# EAGLE design PX4FLOW1.3.1 (EAGLE 6.5.0)

## Sheet 1 of 3
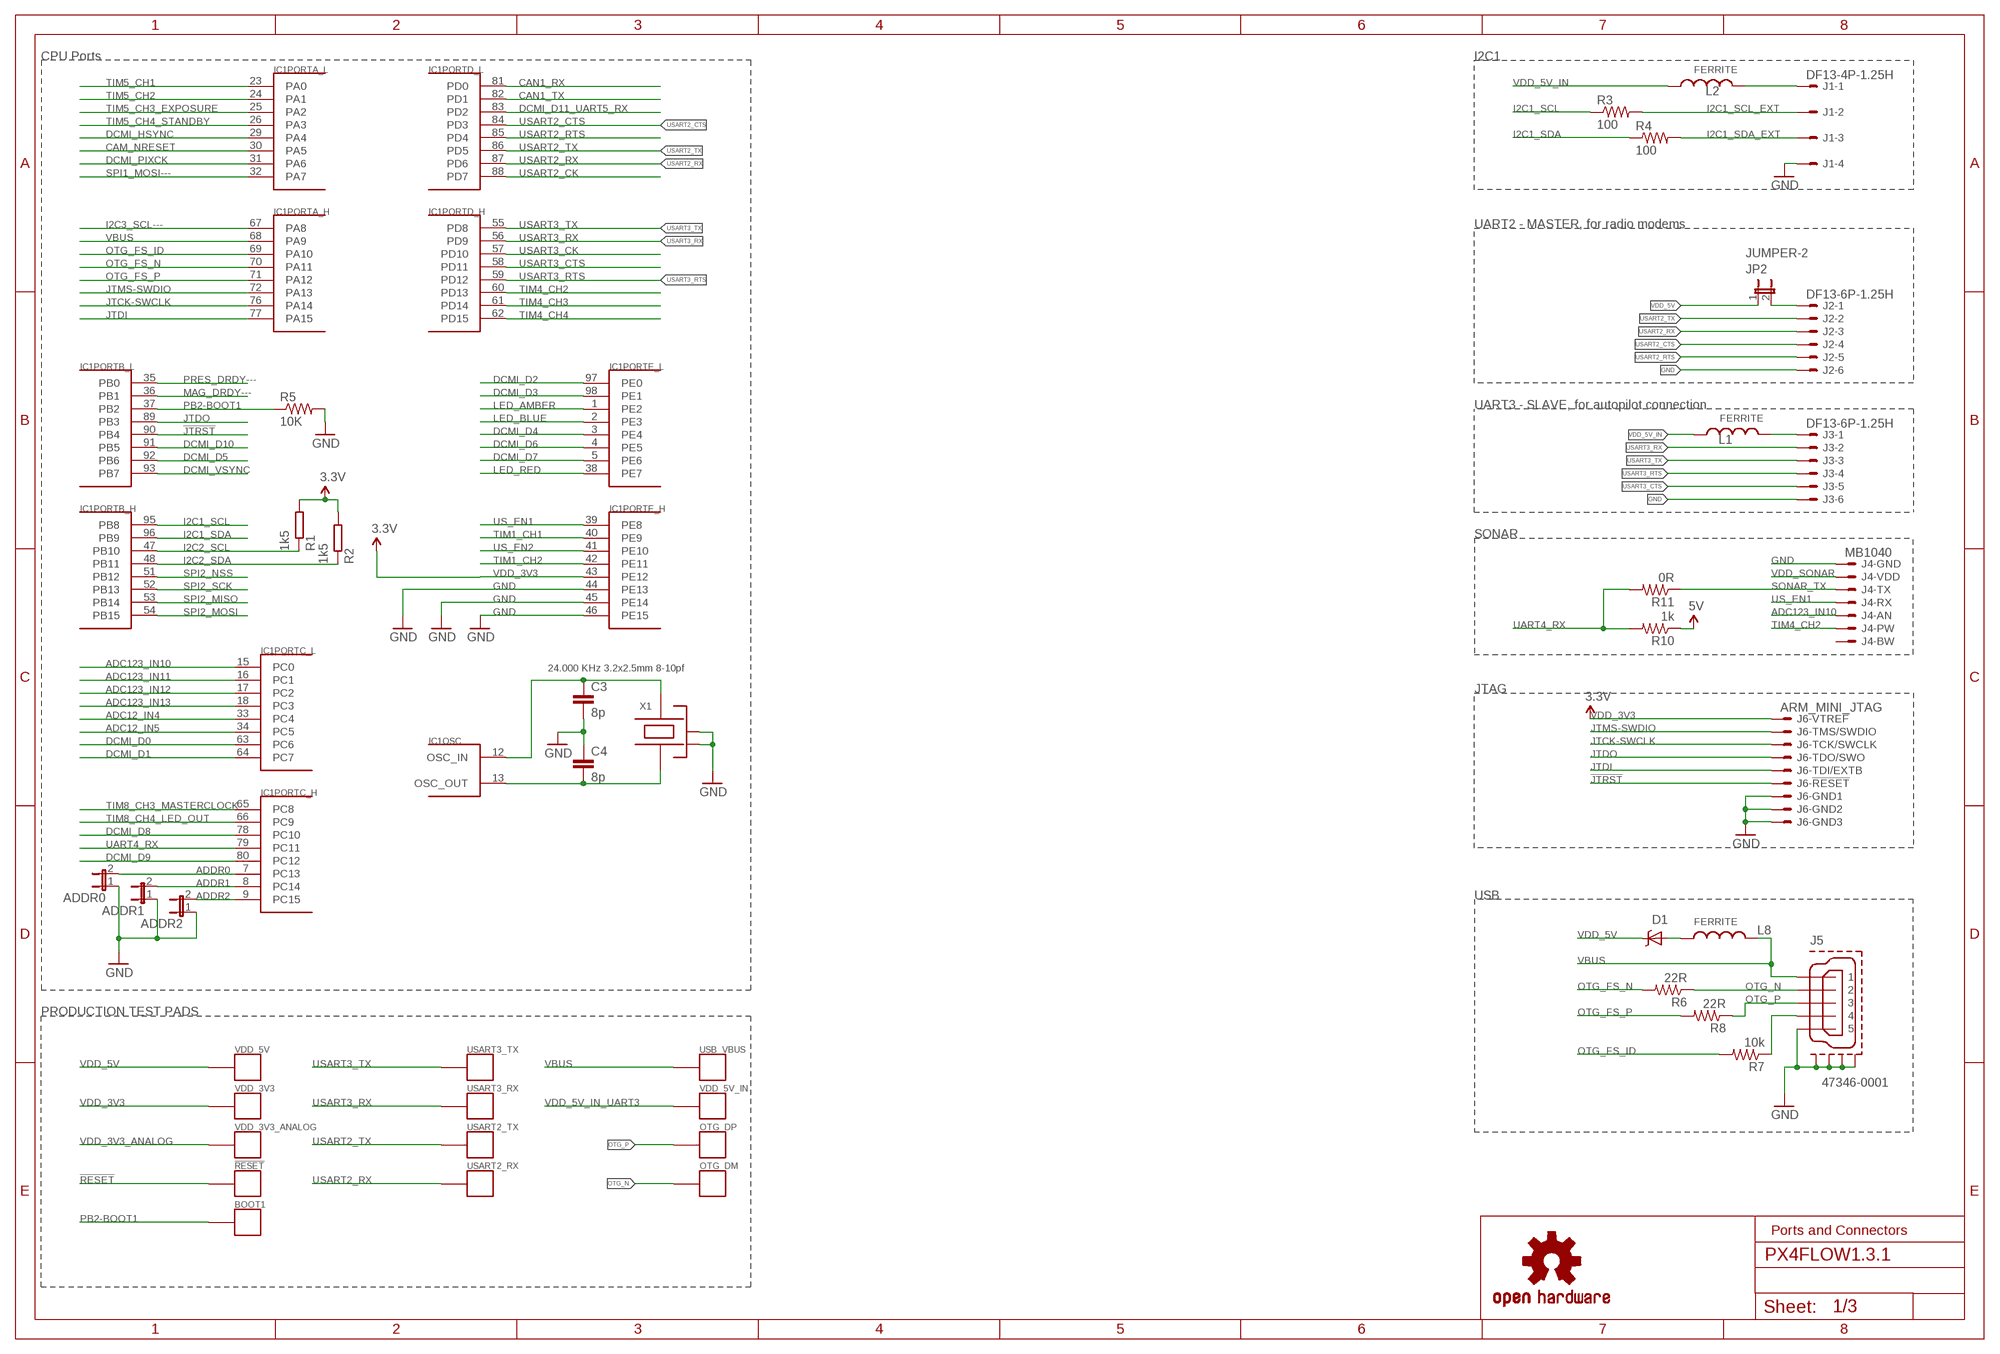
[diagram p0: schematic, sheet 1]

### Parts
!RESET  PAD.04  [PAD.04X.04]
ADDR0  JUMPER-2  [SJ_2]
ADDR1  JUMPER-2  [SJ_2]
ADDR2  JUMPER-2  [SJ_2]
BOOT1  PAD.04  [PAD.04X.04]
C3  8p  CAPACITOR-0402  [0402-CAP]
C4  8p  CAPACITOR-0402  [0402-CAP]
D1  MSS1P4-M3  DIODE-SCHOTTKY_MSMP  [MICROSMP]
IC1  STM32F4X7VX  [TQFP100]
J1  DF13-4P-1.25H  [DF13A-4P-1.25H]
J2  DF13-6P-1.25H  [DF13A-6P-1.25H]
J3  DF13-6P-1.25H  [DF13A-6P-1.25H]
J4  MB1040  MAXSONAR  [MAXSONAR]
J5  47346-0001  MOLEX-47346-0001  [MOLEX-47346-0001]
J6  ARM_MINI_JTAG  ARM_MINI_JTAG-SMT  [FTSH-105-01-XXX-DV-K]
JP2  JUMPER-2  [SJ_2]
L1  FERRITE  INDUCTOR0402  [0402-IND]
L2  FERRITE  INDUCTOR0402  [0402-IND]
L8  FERRITE  INDUCTOR0402  [0402-IND]
OTG_DM  PAD.04  [PAD.04X.04]
OTG_DP  PAD.04  [PAD.04X.04]
R1  1k5  RESISTOR-0402  [0402-RES]
R2  1k5  RESISTOR-0402  [0402-RES]
R3  100  RESISTOR0402-RES  [0402-RES]
R4  100  RESISTOR0402-RES  [0402-RES]
R5  10K  RESISTOR0402-RES  [0402-RES]
R6  22R  RESISTOR0402-RES  [0402-RES]
R7  10k  RESISTOR0402-RES  [0402-RES]
R8  22R  RESISTOR0402-RES  [0402-RES]
R10  1k  RESISTOR0402-RES  [0402-RES]
R11  0R  RESISTOR0402-RES  [0402-RES]
U$10  OSHW-LOGOS  [OSHW-LOGO-S]
USART2_RX  PAD.04  [PAD.04X.04]
USART2_TX  PAD.04  [PAD.04X.04]
USART3_RX  PAD.04  [PAD.04X.04]
USART3_TX  PAD.04  [PAD.04X.04]
USB_VBUS  PAD.04  [PAD.04X.04]
VDD_3V3  PAD.04  [PAD.04X.04]
VDD_3V3_ANALOG  PAD.04  [PAD.04X.04]
VDD_5V  PAD.04  [PAD.04X.04]
VDD_5V_IN  PAD.04  [PAD.04X.04]
X1  24.000 KHz 3.2x2.5mm 8-10pf  OSCILLATOR-3.2X2.5  [OSCILLATOR-3.2X2.5]

### Nets
!JTRST: IC1.90(PORTB_L:PB4) J6.10
!RESET [power]: !RESET.P$1 ; also sheet 2
ADC12_IN4: IC1.33(PORTC_L:PC4)
ADC12_IN5: IC1.34(PORTC_L:PC5)
ADC123_IN10: IC1.15(PORTC_L:PC0) J4.AN
ADC123_IN11: IC1.16(PORTC_L:PC1)
ADC123_IN12: IC1.17(PORTC_L:PC2)
ADC123_IN13: IC1.18(PORTC_L:PC3)
ADDR0: ADDR0.2 IC1.7(PORTC_H:PC13)
ADDR1: ADDR1.2 IC1.8(PORTC_H:PC14)
ADDR2: ADDR2.2 IC1.9(PORTC_H:PC15)
CAM_NRESET: IC1.30(PORTA_L:PA5) ; also sheet 3
CAN1_RX: IC1.81(PORTD_L:PD0)
CAN1_TX: IC1.82(PORTD_L:PD1)
DCMI_D0: IC1.63(PORTC_L:PC6) ; also sheet 3
DCMI_D1: IC1.64(PORTC_L:PC7) ; also sheet 3
DCMI_D2: IC1.97(PORTE_L:PE0) ; also sheet 3
DCMI_D3: IC1.98(PORTE_L:PE1) ; also sheet 3
DCMI_D4: IC1.3(PORTE_L:PE4) ; also sheet 3
DCMI_D5: IC1.92(PORTB_L:PB6) ; also sheet 3
DCMI_D6: IC1.4(PORTE_L:PE5) ; also sheet 3
DCMI_D7: IC1.5(PORTE_L:PE6) ; also sheet 3
DCMI_D8: IC1.78(PORTC_H:PC10) ; also sheet 3
DCMI_D9: IC1.80(PORTC_H:PC12) ; also sheet 3
DCMI_D10: IC1.91(PORTB_L:PB5)
DCMI_D11_UART5_RX: IC1.83(PORTD_L:PD2)
DCMI_HSYNC: IC1.29(PORTA_L:PA4) ; also sheet 3
DCMI_PIXCK: IC1.31(PORTA_L:PA6) ; also sheet 3
DCMI_VSYNC: IC1.93(PORTB_L:PB7) ; also sheet 3
GND [power]: ADDR0.1 ADDR1.1 ADDR2.1 C3.P$2 C4.P$1 IC1.44(PORTE_H:PE13) IC1.45(PORTE_H:PE14) IC1.46(PORTE_H:PE15) J1.4 J2.6 J3.6 J4.GND J5.GND J5.GND1 J5.GND2 J5.GND3 J5.GND4 J6.3 J6.5 J6.9 R5.2 X1.2(NC_2) X1.4(NC_4) ; also sheet 2,3
I2C1_SCL: IC1.95(PORTB_H:PB8) R3.1
I2C1_SCL_EXT: J1.2 R3.2
I2C1_SDA: IC1.96(PORTB_H:PB9) R4.1
I2C1_SDA_EXT: J1.3 R4.2
I2C2_SCL: IC1.47(PORTB_H:PB10) R1.P$1 ; also sheet 2,3
I2C2_SDA: IC1.48(PORTB_H:PB11) R2.P$1 ; also sheet 2,3
I2C3_SCL---: IC1.67(PORTA_H:PA8)
JTCK-SWCLK: IC1.76(PORTA_H:PA14) J6.4
JTDI: IC1.77(PORTA_H:PA15) J6.8
JTDO: IC1.89(PORTB_L:PB3) J6.6
JTMS-SWDIO: IC1.72(PORTA_H:PA13) J6.2
LED_AMBER: IC1.1(PORTE_L:PE2) ; also sheet 2
LED_BLUE: IC1.2(PORTE_L:PE3) ; also sheet 2
LED_RED: IC1.38(PORTE_L:PE7) ; also sheet 2
MAG_DRDY---: IC1.36(PORTB_L:PB1)
N$1: C4.P$2 IC1.13(OSC:OSC_OUT) X1.1
N$2: C3.P$1 IC1.12(OSC:OSC_IN) X1.3
N$3: J1.1 L2.P$2
N$13: J2.1 JP2.2
N$23 [power]: D1.ANODE(A) L8.P$1
OTG_FS_ID: IC1.69(PORTA_H:PA10) R7.2
OTG_FS_N: IC1.70(PORTA_H:PA11) R6.2
OTG_FS_P: IC1.71(PORTA_H:PA12) R8.2
OTG_ID: J5.ID R7.1
OTG_N: J5.D- OTG_DM.P$1 R6.1
OTG_P: J5.D+ OTG_DP.P$1 R8.1
PB2-BOOT1: BOOT1.P$1 IC1.37(PORTB_L:PB2) R5.1
PRES_DRDY---: IC1.35(PORTB_L:PB0)
SONAR_TX: J4.TX R11.1
SPI1_MOSI---: IC1.32(PORTA_L:PA7)
SPI2_MISO: IC1.53(PORTB_H:PB14) ; also sheet 3
SPI2_MOSI: IC1.54(PORTB_H:PB15) ; also sheet 3
SPI2_NSS: IC1.51(PORTB_H:PB12) ; also sheet 3
SPI2_SCK: IC1.52(PORTB_H:PB13) ; also sheet 3
TIM1_CH1: IC1.40(PORTE_H:PE9)
TIM1_CH2: IC1.42(PORTE_H:PE11)
TIM4_CH2: IC1.60(PORTD_H:PD13) J4.PW
TIM4_CH3: IC1.61(PORTD_H:PD14)
TIM4_CH4: IC1.62(PORTD_H:PD15)
TIM5_CH1: IC1.23(PORTA_L:PA0)
TIM5_CH2: IC1.24(PORTA_L:PA1)
TIM5_CH3_EXPOSURE: IC1.25(PORTA_L:PA2) ; also sheet 3
TIM5_CH4_STANDBY: IC1.26(PORTA_L:PA3) ; also sheet 3
TIM8_CH3_MASTERCLOCK: IC1.65(PORTC_H:PC8) ; also sheet 3
TIM8_CH4_LED_OUT: IC1.66(PORTC_H:PC9) ; also sheet 3
UART4_RX: IC1.79(PORTC_H:PC11) R10.2 R11.2
US_EN1: IC1.39(PORTE_H:PE8) J4.RX
US_EN2: IC1.41(PORTE_H:PE10)
USART2_CK: IC1.88(PORTD_L:PD7)
USART2_CTS: IC1.84(PORTD_L:PD3) J2.4
USART2_RTS: IC1.85(PORTD_L:PD4) J2.5
USART2_RX: IC1.87(PORTD_L:PD6) J2.3 USART2_RX.P$1
USART2_TX: IC1.86(PORTD_L:PD5) J2.2 USART2_TX.P$1
USART3_CK: IC1.57(PORTD_H:PD10)
USART3_CTS: IC1.58(PORTD_H:PD11) J3.5
USART3_RTS: IC1.59(PORTD_H:PD12) J3.4
USART3_RX: IC1.56(PORTD_H:PD9) J3.2 USART3_RX.P$1
USART3_TX: IC1.55(PORTD_H:PD8) J3.3 USART3_TX.P$1
VBUS [power]: IC1.68(PORTA_H:PA9) J5.VBUS L8.P$2 USB_VBUS.P$1
VDD_3V3 [power]: IC1.43(PORTE_H:PE12) J6.1 R1.P$2 R2.P$2 VDD_3V3.P$1 ; supply symbol labelled 3.3V ; also sheet 2,3
VDD_3V3_ANALOG [power]: VDD_3V3_ANALOG.P$1 ; also sheet 2,3
VDD_5V [power]: D1.CATHODE(C) JP2.1 R10.1 VDD_5V.P$1 ; supply symbol labelled 5V ; also sheet 2
VDD_5V_IN [power]: L1.P$1 L2.P$1 ; also sheet 2
VDD_5V_IN_UART3: J3.1 L1.P$2 VDD_5V_IN.P$1
VDD_SONAR: J4.VDD ; also sheet 2
Unconnected: J4.BW

### Notes on the sheet
- CPU Ports | I2C1
- UART2 - MASTER, for radio modems
- UART3 - SLAVE, for autopilot connection
- SONAR
- JTAG
- USB
- PRODUCTION TEST PADS
- Ports and Connectors

## Sheet 2 of 3
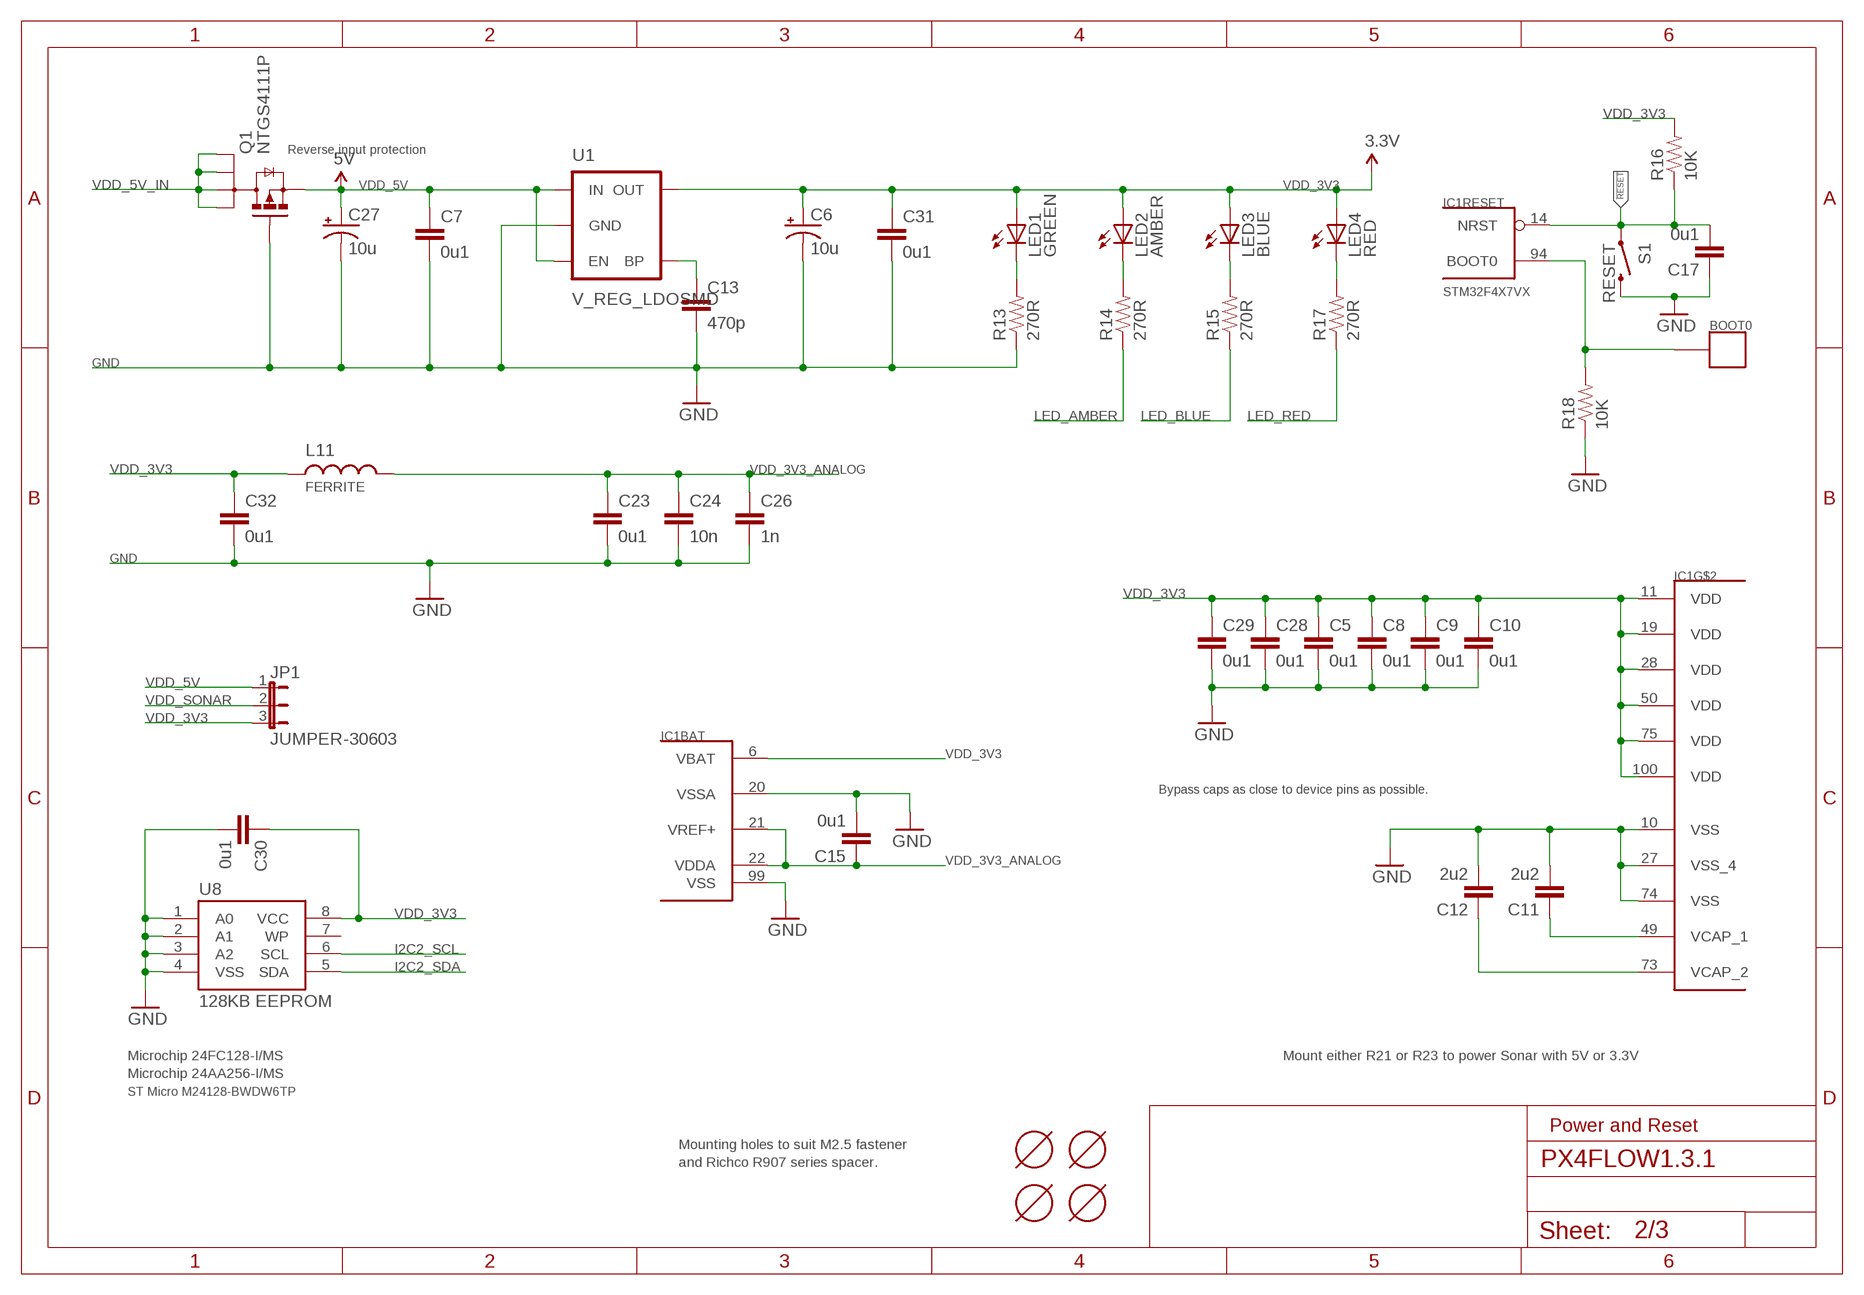
[diagram p1: schematic, sheet 2]

### Parts
BOOT0  PAD.05  [PAD.05X.05]
C5  0u1  CAP0402-CAP  [0402-CAP]
C6  10u  CAP_POL1206  [EIA3216]
C7  0u1  CAP0402-CAP  [0402-CAP]
C8  0u1  CAP0402-CAP  [0402-CAP]
C9  0u1  CAP0402-CAP  [0402-CAP]
C10  0u1  CAP0402-CAP  [0402-CAP]
C11  2u2  CAP0402-CAP  [0402-CAP]
C12  2u2  CAP0402-CAP  [0402-CAP]
C13  470p  CAP0402-CAP  [0402-CAP]
C15  0u1  CAP0402-CAP  [0402-CAP]
C17  0u1  CAP0402-CAP  [0402-CAP]
C23  0u1  CAP0402-CAP  [0402-CAP]
C24  10n  CAP0402-CAP  [0402-CAP]
C26  1n  CAP0402-CAP  [0402-CAP]
C27  10u  CAP_POL1206  [EIA3216]
C28  0u1  CAP0402-CAP  [0402-CAP]
C29  0u1  CAP0402-CAP  [0402-CAP]
C30  0u1  CAP0402-CAP  [0402-CAP]
C31  0u1  CAP0402-CAP  [0402-CAP]
C32  0u1  CAP0402-CAP  [0402-CAP]
JP1  JUMPER-30603  [SJ_3_0603_PASTE1&2]
L11  FERRITE  INDUCTOR0402  [0402-IND]
LED1  GREEN  LED0603  [LED-0603]
LED2  AMBER  LED0603  [LED-0603]
LED3  BLUE  LED0603  [LED-0603]
LED4  RED  LED0603  [LED-0603]
Q1  NTGS4111P  [TSOP-6]
R13  270R  RESISTOR0402-RES  [0402-RES]
R14  270R  RESISTOR0402-RES  [0402-RES]
R15  270R  RESISTOR0402-RES  [0402-RES]
R16  10K  RESISTOR0402-RES  [0402-RES]
R17  270R  RESISTOR0402-RES  [0402-RES]
R18  10K  RESISTOR0402-RES  [0402-RES]
S1  RESET  SWITCH-MOMENTARY-2  [EVQP7J01K]
U1  V_REG_LDOSMD  [SOT23-5]
U8  128KB EEPROM  EEPROM-I2CMSOP  [MSOP-8]
U$1  MOUNT-HOLE3.1MM  [MOUNT-HOLE3.1]
U$2  MOUNT-HOLE3.1MM  [MOUNT-HOLE3.1]
U$3  MOUNT-HOLE3.1MM  [MOUNT-HOLE3.1]
U$4  MOUNT-HOLE3.1MM  [MOUNT-HOLE3.1]

### Nets
!RESET [power]: C17.2 IC1.14(RESET:NRST) R16.1 S1.A1 ; also sheet 1
BOOT0: BOOT0.P$1 IC1.94(RESET:BOOT0) R18.2
GND [power]: C5.2 C6.C(-) C7.2 C8.2 C9.2 C10.2 C11.2 C12.2 C13.2 C15.2 C17.1 C23.2 C24.2 C26.2 C27.C(-) C28.2 C29.2 C30.2 C31.2 C32.2 IC1.10(VSS) IC1.20(BAT:VSSA) IC1.27(VSS_4) IC1.74(VSS) IC1.99(BAT:VSS) Q1.3(G) R13.1 R18.1 S1.B3 U1.2(GND) U8.1(A0) U8.2(A1) U8.3(A2) U8.4(VSS) ; also sheet 1,3
I2C2_SCL: U8.6(SCL) ; also sheet 1,3
I2C2_SDA: U8.5(SDA) ; also sheet 1,3
LED_AMBER: R14.1 ; also sheet 1
LED_BLUE: R15.1 ; also sheet 1
LED_RED: R17.1 ; also sheet 1
N$4: C13.1 U1.4(BP)
N$8: LED4.C R17.2
N$28: LED3.C R15.2
N$29: LED1.C R13.2
N$30: LED2.C R14.2
VCAP_1: C11.1 IC1.49(VCAP_1)
VCAP_2: C12.1 IC1.73(VCAP_2)
VDD_3V3 [power]: C5.1 C6.A(+) C8.1 C9.1 C10.1 C28.1 C29.1 C30.1 C31.1 C32.1 IC1.6(BAT:VBAT) IC1.11(VDD) IC1.19(VDD) IC1.28(VDD) IC1.50(VDD) IC1.75(VDD) IC1.100(VDD) JP1.3 L11.P$1 LED1.A LED2.A LED3.A LED4.A R16.2 U1.5(OUT) U8.8(VCC) ; supply symbol labelled 3.3V ; also sheet 1,3
VDD_3V3_ANALOG [power]: C15.1 C23.1 C24.1 C26.1 IC1.21(BAT:VREF+) IC1.22(BAT:VDDA) L11.P$2 ; also sheet 1,3
VDD_5V [power]: C7.1 C27.A(+) JP1.1 Q1.4(S) U1.1(IN) U1.3(EN) ; supply symbol labelled 5V ; also sheet 1
VDD_5V_IN [power]: Q1.1(D) Q1.2(D1) Q1.5(D2) Q1.6(D3) ; also sheet 1
VDD_SONAR: JP1.2 ; also sheet 1
Unconnected: U8.7(WP)

### Notes on the sheet
- Reverse input protection
- Bypass caps as close to device pins as possible.
- Microchip 24FC128-I/MS | Mount either R21 or R23 to power Sonar with 5V or 3.3V
- Microchip 24AA256-I/MS
- ST Micro M24128-BWDW6TP
- Power and Reset
- Mounting holes to suit M2.5 fastener
- and Richco R907 series spacer.

## Sheet 3 of 3
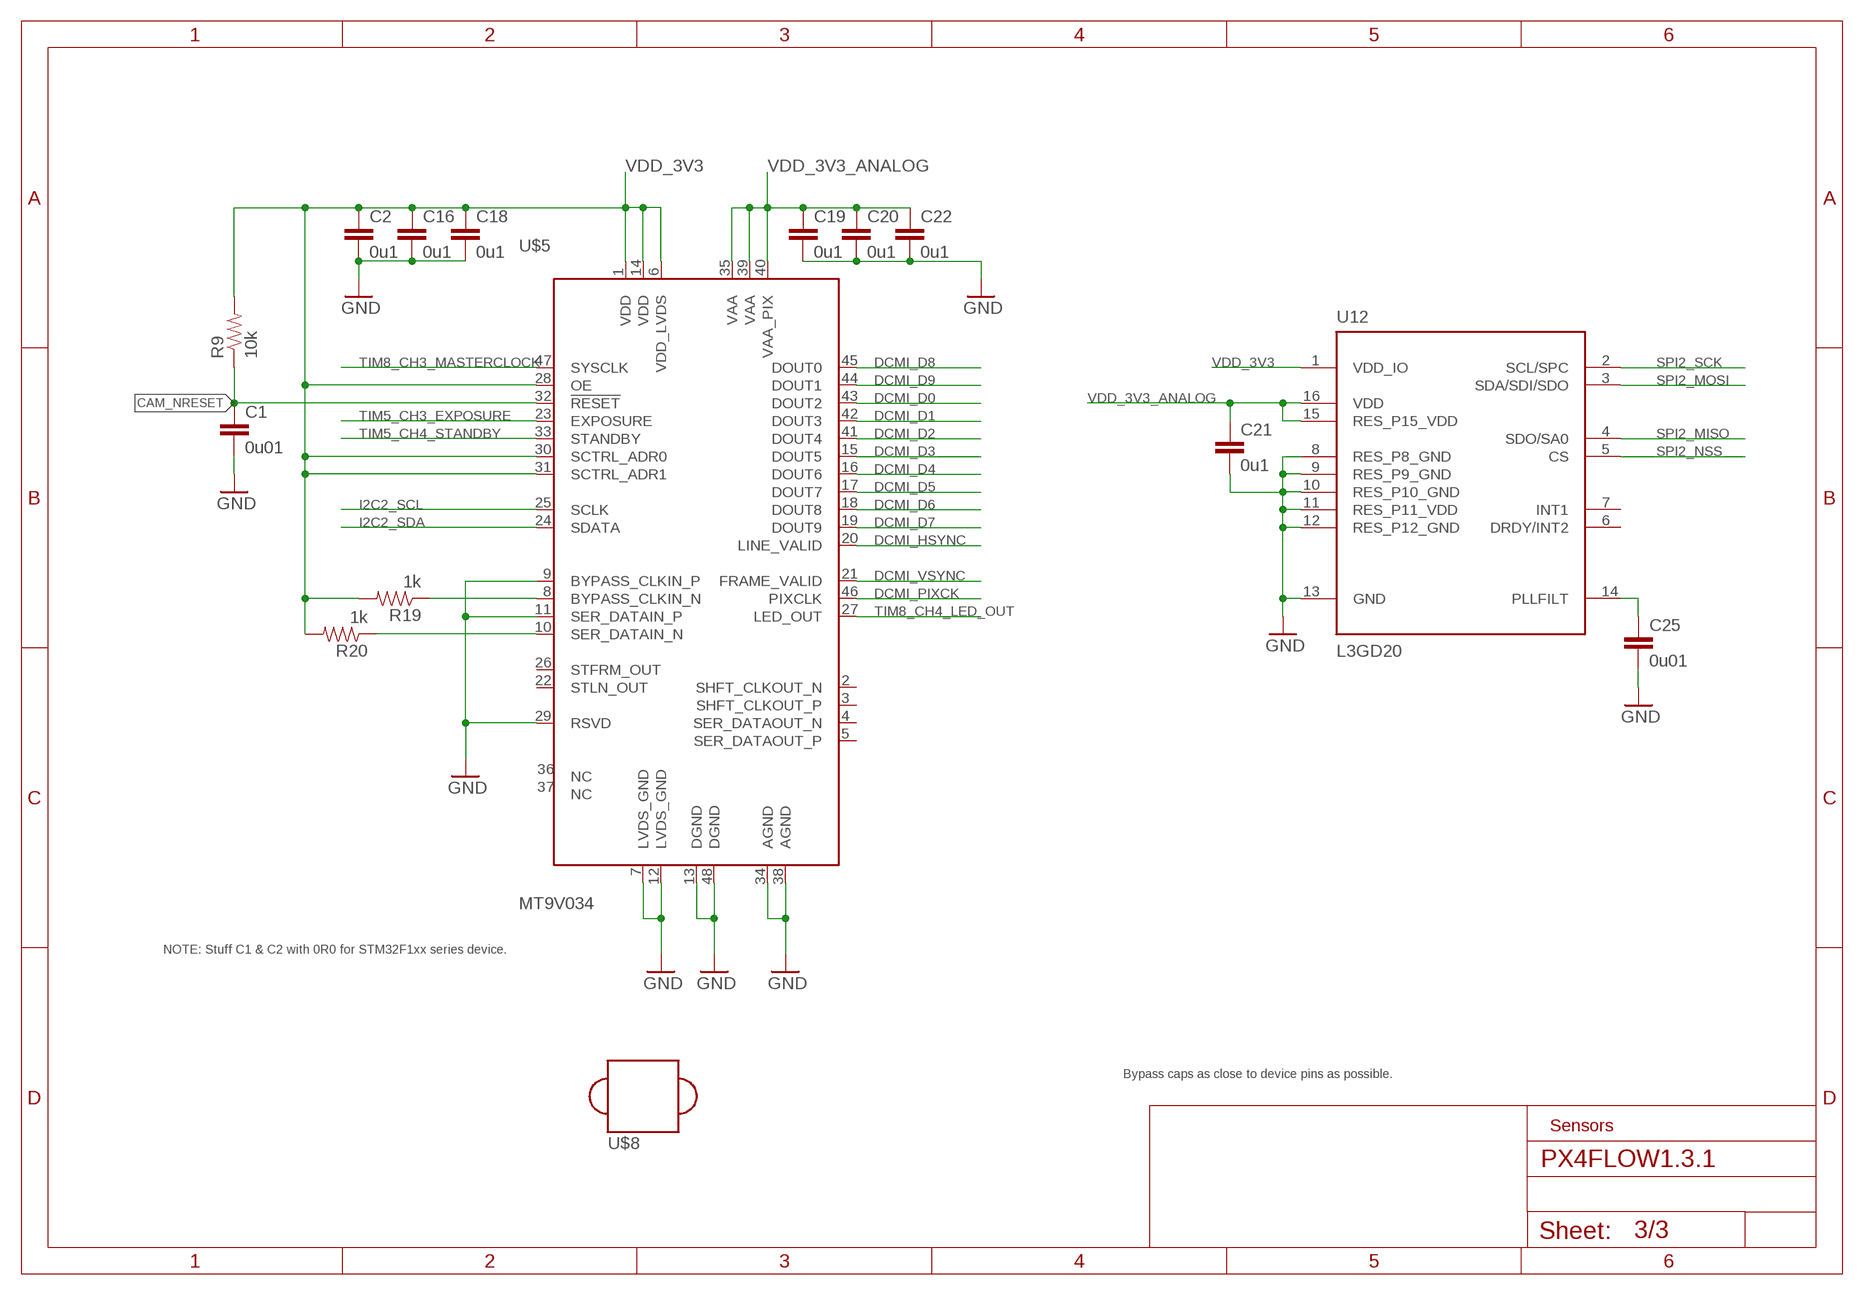
[diagram p2: schematic, sheet 3]

### Parts
C1  0u01  CAP0402-CAP  [0402-CAP]
C2  0u1  CAP0402-CAP  [0402-CAP]
C16  0u1  CAP0402-CAP  [0402-CAP]
C18  0u1  CAP0402-CAP  [0402-CAP]
C19  0u1  CAP0402-CAP  [0402-CAP]
C20  0u1  CAP0402-CAP  [0402-CAP]
C21  0u1  CAP0402-CAP  [0402-CAP]
C22  0u1  CAP0402-CAP  [0402-CAP]
C25  0u01  CAP0402-CAP  [0402-CAP]
R9  10k  RESISTOR0402-RES  [0402-RES]
R19  1k  RESISTOR0402-RES  [0402-RES]
R20  1k  RESISTOR0402-RES  [0402-RES]
U12  L3GD20  L3G4200DH-LL  [L3G4200DH-MAN]
U$5  MT9V034  [CLCC-48]
U$8  LENSMOUNT_M12  [LENSMOUNT_LARGE_M12]

### Nets
CAM_NRESET: C1.1 R9.1 U$5.32(!RESET) ; also sheet 1
DCMI_D0: U$5.43(DOUT2) ; also sheet 1
DCMI_D1: U$5.42(DOUT3) ; also sheet 1
DCMI_D2: U$5.41(DOUT4) ; also sheet 1
DCMI_D3: U$5.15(DOUT5) ; also sheet 1
DCMI_D4: U$5.16(DOUT6) ; also sheet 1
DCMI_D5: U$5.17(DOUT7) ; also sheet 1
DCMI_D6: U$5.18(DOUT8) ; also sheet 1
DCMI_D7: U$5.19(DOUT9) ; also sheet 1
DCMI_D8: U$5.45(DOUT0) ; also sheet 1
DCMI_D9: U$5.44(DOUT1) ; also sheet 1
DCMI_HSYNC: U$5.20(LINE_VALID) ; also sheet 1
DCMI_PIXCK: U$5.46(PIXCLK) ; also sheet 1
DCMI_VSYNC: U$5.21(FRAME_VALID) ; also sheet 1
GND [power]: C1.2 C2.2 C16.2 C18.2 C19.2 C20.2 C21.2 C22.2 C25.2 U12.8(RES_P8_GND) U12.9(RES_P9_GND) U12.10(RES_P10_GND) U12.11(RES_P11_VDD) U12.12(RES_P12_GND) U12.13(GND) U$5.7(LVDS_GND) U$5.9(BYPASS_CLKIN_P) U$5.11(SER_DATAIN_P) U$5.12(LVDS_GND) U$5.13(DGND) U$5.29(RSVD) U$5.34(AGND) U$5.38(AGND) U$5.48(DGND) ; also sheet 1,2
I2C2_SCL: U$5.25(SCLK) ; also sheet 1,2
I2C2_SDA: U$5.24(SDATA) ; also sheet 1,2
N$10: R19.1 U$5.8(BYPASS_CLKIN_N)
N$11: R20.1 U$5.10(SER_DATAIN_N)
N$34: C25.1 U12.14(PLLFILT)
SPI2_MISO: U12.4(SDO/SA0) ; also sheet 1
SPI2_MOSI: U12.3(SDA/SDI/SDO) ; also sheet 1
SPI2_NSS: U12.5(CS) ; also sheet 1
SPI2_SCK: U12.2(SCL/SPC) ; also sheet 1
TIM5_CH3_EXPOSURE: U$5.23(EXPOSURE) ; also sheet 1
TIM5_CH4_STANDBY: U$5.33(STANDBY) ; also sheet 1
TIM8_CH3_MASTERCLOCK: U$5.47(SYSCLK) ; also sheet 1
TIM8_CH4_LED_OUT: U$5.27(LED_OUT) ; also sheet 1
VDD_3V3 [power]: C2.1 C16.1 C18.1 R9.2 R19.2 R20.2 U12.1(VDD_IO) U$5.1(VDD) U$5.6(VDD_LVDS) U$5.14(VDD) U$5.28(OE) U$5.30(SCTRL_ADR0) U$5.31(SCTRL_ADR1) ; also sheet 1,2
VDD_3V3_ANALOG [power]: C19.1 C20.1 C21.1 C22.1 U12.15(RES_P15_VDD) U12.16(VDD) U$5.35(VAA) U$5.39(VAA) U$5.40(VAA_PIX) ; also sheet 1,2
Unconnected: U12.6(DRDY/INT2) U12.7(INT1) U$5.2(SHFT_CLKOUT_N) U$5.3(SHFT_CLKOUT_P) U$5.4(SER_DATAOUT_N) U$5.5(SER_DATAOUT_P) U$5.22(STLN_OUT) U$5.26(STFRM_OUT) U$5.36(NC) U$5.37(NC)

### Notes on the sheet
- NOTE: Stuff C1 & C2 with 0R0 for STM32F1xx series device.
- Bypass caps as close to device pins as possible.
- Sensors

## Library data of the parts
!RESET BOOT0 BOOT1 OTG_DM OTG_DP USART2_RX USART2_TX USART3_RX USART3_TX USB_VBUS VDD_3V3 VDD_3V3_ANALOG VDD_5V VDD_5V_IN = pixhawk2:PAD: Test pad This footprint includes three classes: The actual test pads, a pogo-pin footprint to mount the pogo-pin as through-hole part and a hole footprint which allows the head of the pogo-pin to pass through (do NOT use the hole to mount the pogo-pin). In a typical test setup, the stack would consist of three PCBs: The actual PCB under testing with a test pad on the bottom, then a second PCB with the hole for the pogo-pin head where the PCB under testing is pressed on and a third PCB at 30 mm / 1.2" distance with the pogo-pin footprints. The pogo-pins are soldered to the last PCB. To create the stack, copy the board under testing and exchange the footprints - this way the correct positioning is ensured.; BOM: EXCLUDE; PARTNO: *
ADDR0 ADDR1 ADDR2 JP2 = pixhawk2:JUMPER-2; BOM: EXCLUDE; PARTNO: *
C1 C25 = pixhawk2:CAP: Capacitor Standard 0603 ceramic capacitor, and 0.1" leaded capacitor.; PARTNO: CC0402KRX7R7BB103
C2 C5 C7-C10 C15-C24 C26 C28-C32 = pixhawk2:CAP: Capacitor Standard 0603 ceramic capacitor, and 0.1" leaded capacitor.; PARTNO: CC0402ZRY5V7BB104
C3 C4 = pel_dipol_comp:CAPACITOR
C6 C27 = pixhawk2:CAP_POL: Capacitor Polarized These are standard SMD and PTH capacitors. Normally 10uF, 47uF, and 100uF in electrolytic and tantalum varieties. Always verify the external diameter of the through hole cap, it varies with capacity, voltage, and manufacturer. The EIA devices should be standard.; PARTNO: F931A106MAA
C11 C12 = pixhawk2:CAP: Capacitor Standard 0603 ceramic capacitor, and 0.1" leaded capacitor.; PARTNO: C1608Y5V1C225Z
C13 = pixhawk2:CAP: Capacitor Standard 0603 ceramic capacitor, and 0.1" leaded capacitor.; PARTNO: CC0402KRX7R9BB471
D1 = pixhawk2:DIODE-SCHOTTKY: Schottky barrier diode in DO214AC, e.g. Fairchild SS14.; PARTNO: MSS1P4-M3/89A
IC1 = pixhawk2:STM32F4X7VX: STM32F4X7VX 100 pin LQFP STM32F407VE - 512 KB flash, no crypto STM32F407VG - 1 MB flash, no crypto STM32F417VE - 512 KB flash, with crypto STM32F417VG - 1 MB flash, with crypto; PARTNO: STM32F407VGT6
J1 = pixhawk2:DF13-4P-1.25?; PARTNO: DF13A-4P-1.25H(20)
J2 J3 = pixhawk2:DF13-6P-1.25?; PARTNO: DF13A-6P-1.25H(20)
J4 = pixhawk2:MAXSONAR; BOM: EXCLUDE; PARTNO: *
J5 = pixhawk2:MOLEX-47346-0001: MICRO USB B, BOTTOM MOUNT; PARTNO: 47346-0001
J6 = pixhawk2:ARM_MINI_JTAG: CONNECTOR wire to board 1.25 mm (.049 inch) pitch header; PARTNO: M50-3900542
JP1 = pixhawk2:JUMPER-3; PARTNO: RMCF0402ZT0R00
L1 L2 L8 L11 = pixhawk2:INDUCTOR: Inductors Basic Inductor/Choke - 0603 and 1210. Footprints are not proven and vary greatly between part numbers. SRR1210: Bourns SRR1210 parts, e.g. SRR1210-100M; PARTNO: BKP1005HS121-T
LED1 = pixhawk2:LED: LEDs Standard schematic elements and footprints for 5mm, 3mm, 1206, and 0603 sized LEDs. 5mm - Spark Fun Electronics SKU : COM-00529 (and others); PARTNO: LNJ337W83RA
LED2 = pixhawk2:LED: LEDs Standard schematic elements and footprints for 5mm, 3mm, 1206, and 0603 sized LEDs. 5mm - Spark Fun Electronics SKU : COM-00529 (and others); PARTNO: LNJ437W84RA
LED3 = pixhawk2:LED: LEDs Standard schematic elements and footprints for 5mm, 3mm, 1206, and 0603 sized LEDs. 5mm - Spark Fun Electronics SKU : COM-00529 (and others); PARTNO: LNJ937W8CRA
LED4 = pixhawk2:LED: LEDs Standard schematic elements and footprints for 5mm, 3mm, 1206, and 0603 sized LEDs. 5mm - Spark Fun Electronics SKU : COM-00529 (and others); PARTNO: LNJ237W82RA
Q1 = pixhawk2:NTGS4111P; PARTNO: NTGS4111P
R1 R2 = pel_dipol_comp:RESISTOR
R3 R4 = pixhawk2:RESISTOR: Resistor Basic schematic elements and footprints for 0603, 1206, and PTH 1/10th watt (small) resistors.; PARTNO: RMCF0402JT100R
R5 R16 R18 = pixhawk2:RESISTOR: Resistor Basic schematic elements and footprints for 0603, 1206, and PTH 1/10th watt (small) resistors.; PARTNO: RMCF0402FT10K0
R6 R8 = pixhawk2:RESISTOR: Resistor Basic schematic elements and footprints for 0603, 1206, and PTH 1/10th watt (small) resistors.; PARTNO: RMCF0402JT22R0
R7 = pixhawk2:RESISTOR: Resistor Basic schematic elements and footprints for 0603, 1206, and PTH 1/10th watt (small) resistors.; PARTNO: MFR-25FBF-10K0
R9 R13 R14 = pixhawk2:RESISTOR: Resistor Basic schematic elements and footprints for 0603, 1206, and PTH 1/10th watt (small) resistors.; PARTNO: MCR01MZPJ271
R10 R11 R19 R20 = pixhawk2:RESISTOR: Resistor Basic schematic elements and footprints for 0603, 1206, and PTH 1/10th watt (small) resistors.; PARTNO: RMCF0402JT1K00
R15 R17 = pixhawk2:RESISTOR: Resistor Basic schematic elements and footprints for 0603, 1206, and PTH 1/10th watt (small) resistors.; PARTNO: MCR01MZPJ820
S1 = pixhawk2:SWITCH-MOMENTARY-2; PARTNO: EVQP7J01K
U1 = pixhawk2:V_REG_LDO: Voltage Regulator LDO Standard 150mA LDO voltage regulator in SOT-23 layout. Micrel part MIC5205. BP (by-pass) pin is used to lower output noise with 470pF cap.; PARTNO: MIC5207-3.3YM5
U8 = pixhawk2:EEPROM-I2C: I2C EEPROM Generic footprint for I2C EEPROMS. Compatible types include: Microchip 24FC128-I/MS Microchip 24AA256-I/MS ST Microelectronics M24128-BWDW6TP; PARTNO: 24FC128-I/MS
U12 = pixhawk2:L3G4200DH: L3G4200DH - Digital 3-axis Gyroscope The L3G4200DH is a low-power three-axis angular rate sensor. The L3G4200DH has a full scale of ±250/±500/ ±2000 dps and is capable of measuring rates with a user-selectable bandwidth. It can operate within a temperature range from -40 °C to +85 °C. Supply voltage: 2.4 V to 3.6 V. Full datasheet: L3G4200DH Datasheet <http://www.st.com/stonline/products/literature/ds/17300.pdf>; PARTNO: L3GD20
U$1-U$4 = pixhawk2:MOUNT-HOLE; BOM: EXCLUDE; PARTNO: *
U$5 = pixhawk2:MT9V034; PARTNO: MT9V034C12STM
U$8 = pixhawk2:LENSMOUNT_M12: Point Grey compatible M12 lens mount; BOM: EXCLUDE; PARTNO: *
U$10 = pixhawk2:OSHW-LOGO: Open Source Hardware Logo This logo indicates the piece of hardware it is found on incorporates a OSHW license and/or adheres to the definition of open source hardware found here: http://freedomdefined.org/OSHW; BOM: EXCLUDE; PARTNO: *
X1 = pixhawk2:OSCILLATOR: Crystal Oscillator in 3.2x2.5 SMD; PARTNO: NX3225SA-24.000000MHZ

## Net classes
0 signal: width 0.2 mm, drill 0.3 mm, clearance 0.15 mm
1 power: width 0.25 mm, drill 0.3 mm, clearance 0.15 mm

## Board
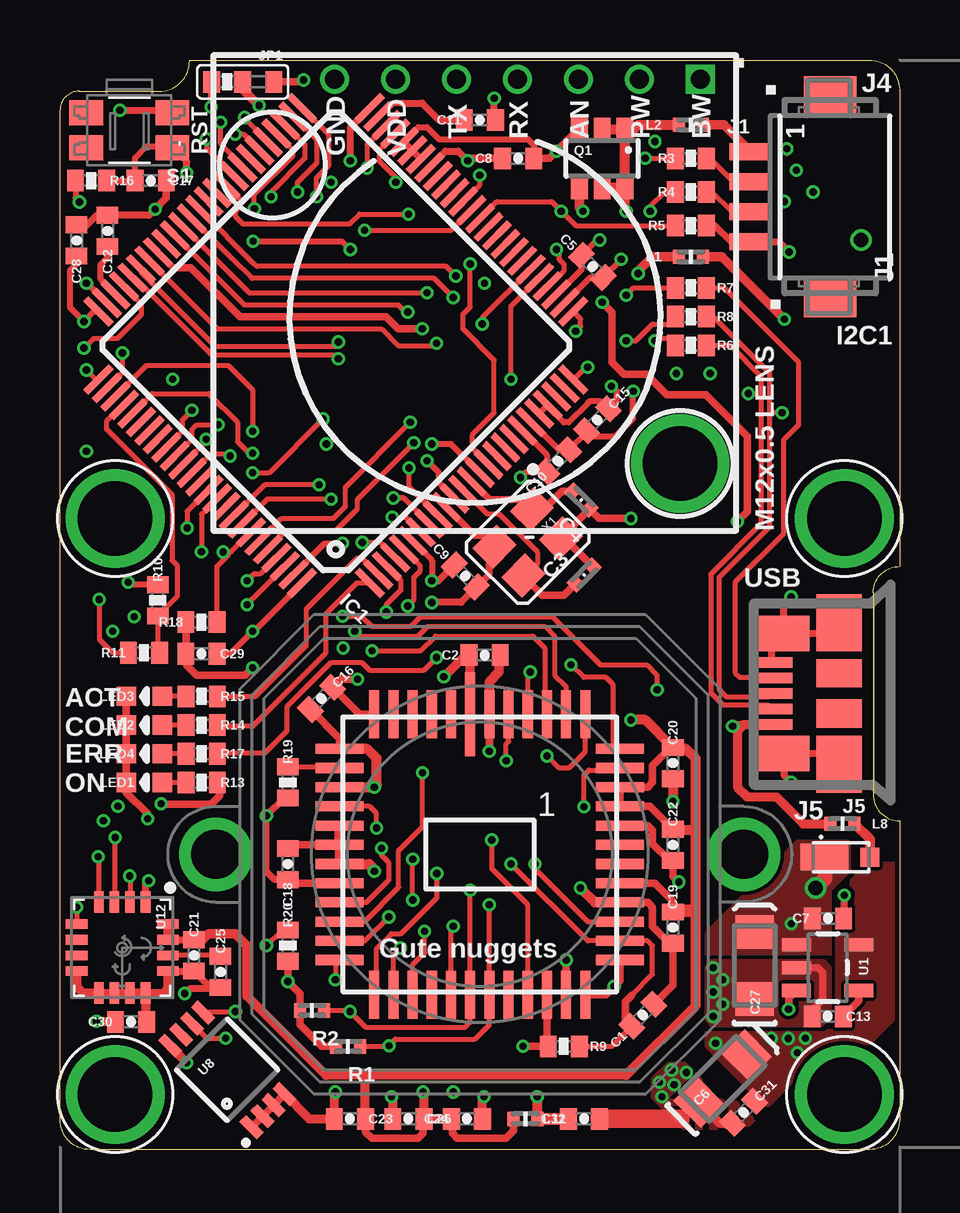
[diagram p3: board, top side]
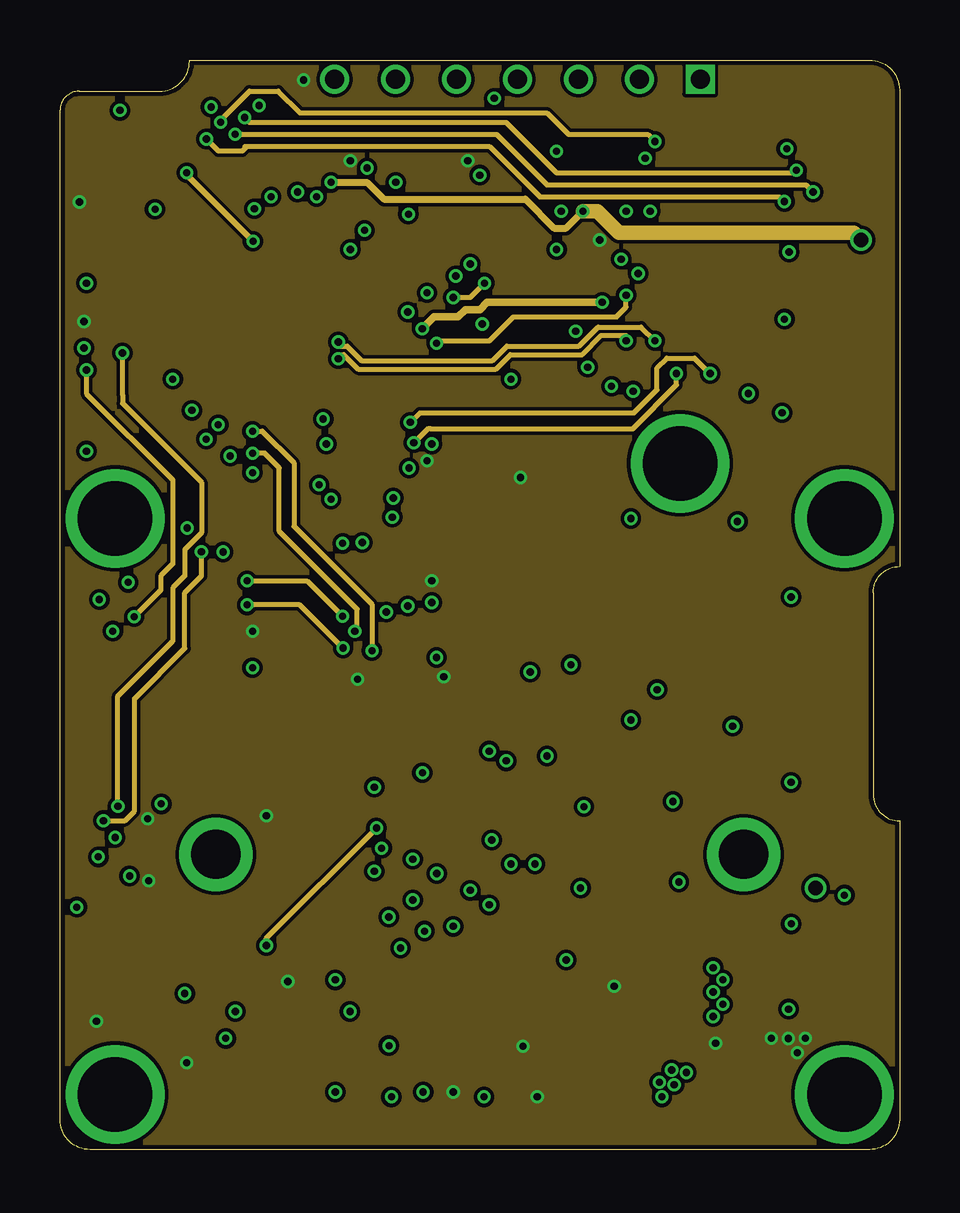
[diagram p4: board, inner layer Route2]
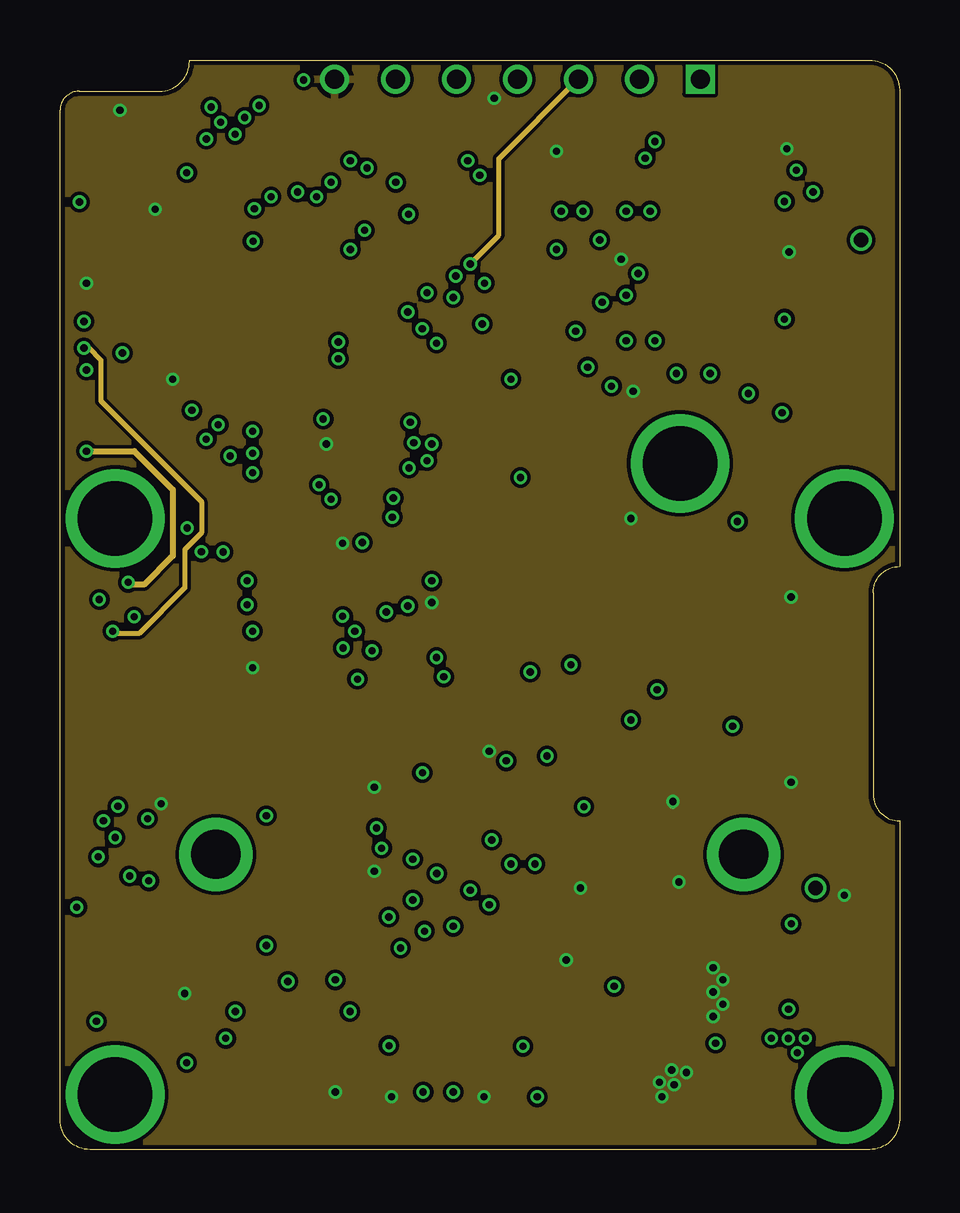
[diagram p5: board, inner layer Route15]
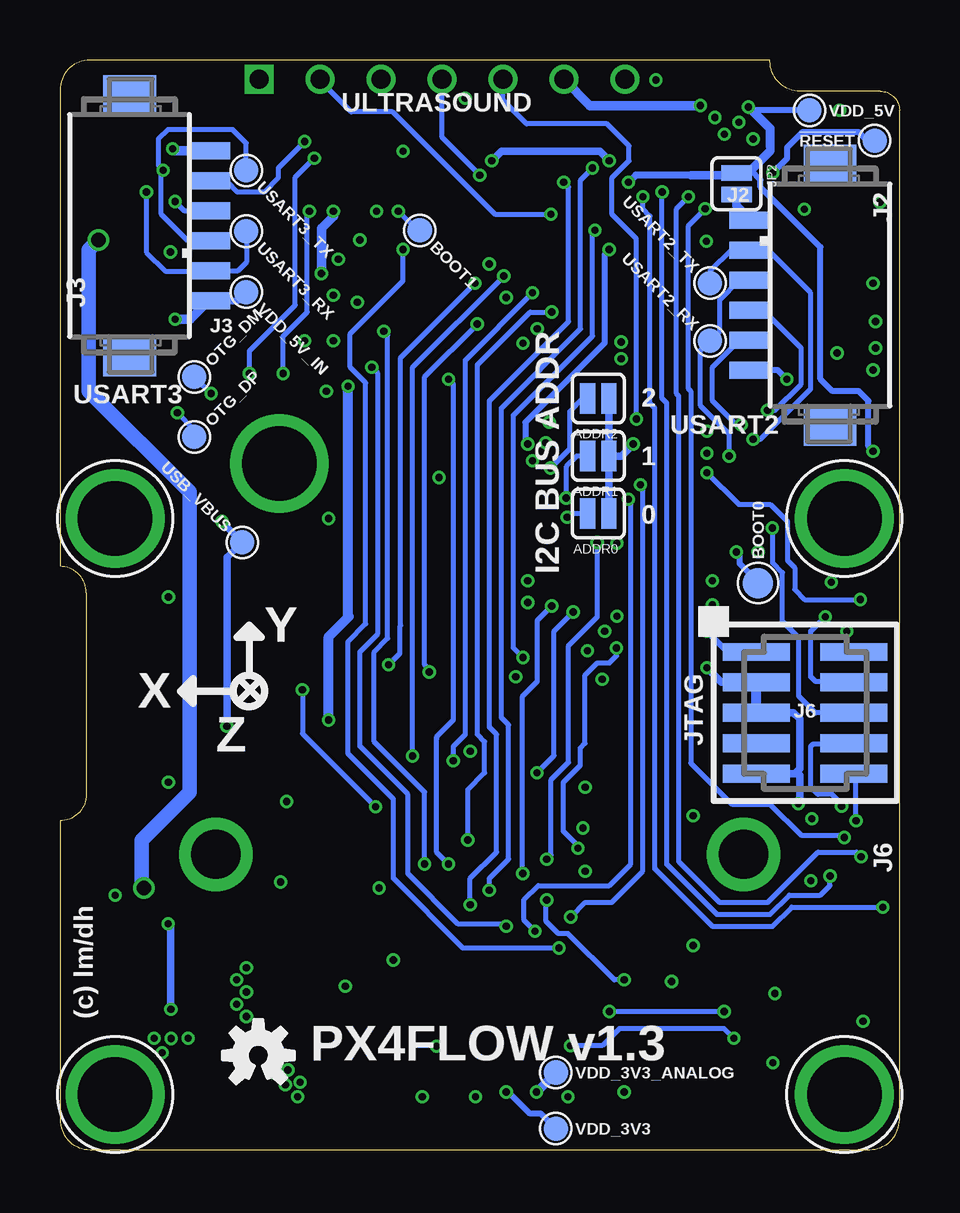
[diagram p6: board, bottom side, seen from below]

Size 35 x 45.4 mm. Coordinates in mm from the lower left corner, seen from the top.
Outline: 5.4,45.4 33.75,45.4 arc-90 35,44.15 35,24.3 arc90 33.9,23.2 33.9,14.8 arc90 35,13.7 35,1.25 arc-90 33.75,0 1.25,0 arc-90 0,1.25 0,43.3 arc-90 0.8,44.1 4.15,44.1 arc90 5.4,45.35 5.4,45.4
Copper layers (1*2*15*16): Top 0.035mm / dielectric 0.5mm / Route2 0.035mm / dielectric 0.5mm / Route15 0.035mm / dielectric 0.5mm / Bottom 0.035mm
Design rules "default": minimum track width 0.15mm, minimum drill 0.3mm, track to track 0.15mm, track to pad 0.15mm, pad to pad 0.15mm, via to via 0.15mm, smd to smd 0.15mm, copper to edge 0.2mm, drill to drill 0.2mm, minimum pad ring 0.125mm, minimum via ring 0.125mm, stop-mask expansion 1mil, vias tented up to drill 0.31mm, thermal gap 8mil

### Footprints (pad centres in the part's own frame; a part is rotated, then mirrored left to right if it is on the bottom)
PAD.04X.04 = smd 1.016 x 1.016: P$1 0,0
SJ_2 = smd 0.635 x 1.27: 1 -0.889,0; 2 0,0
PAD.05X.05 = smd 1.27 x 1.27: P$1 0,0
0402-CAP = smd 0.7 x 0.9: 1 -0.65,0; 2 0.65,0
0402-CAP' = smd 0.5 x 0.6: P$1 -0.5,0; P$2 0.5,0
EIA3216 = smd 1.4 x 1.6: A 1.4,0; C -1.4,0
MICROSMP = smd 0.8 x 0.8: ANODE 0.65,0 | smd 2 x 1.1: CATHODE -1.25,0
TQFP100 = smd 1.5 x 0.29: 1 -8,6; 2 -8,5.5; 3 -8,5; 4 -8,4.5; 5 -8,4; 6 -8,3.5; 7 -8,3; 8 -8,2.5; 9 -8,2; 10 -8,1.5; 11 -8,1; 12 -8,0.5; 13 -8,0; 14 -8,-0.5; 15 -8,-1; 16 -8,-1.5; 17 -8,-2; 18 -8,-2.5; 19 -8,-3; 20 -8,-3.5; 21 -8,-4; 22 -8,-4.5; 23 -8,-5; 24 -8,-5.5; 25 -8,-6; 51 8,-6; 52 8,-5.5; 53 8,-5; 54 8,-4.5; 55 8,-4; 56 8,-3.5; 57 8,-3; 58 8,-2.5; 59 8,-2; 60 8,-1.5; 61 8,-1; 62 8,-0.5; 63 8,0; 64 8,0.5; 65 8,1; 66 8,1.5; 67 8,2; 68 8,2.5; 69 8,3; 70 8,3.5; 71 8,4; 72 8,4.5; 73 8,5; 74 8,5.5; 75 8,6 | smd 0.29 x 1.5: 26 -6,-8; 27 -5.5,-8; 28 -5,-8; 29 -4.5,-8; 30 -4,-8; 31 -3.5,-8; 32 -3,-8; 33 -2.5,-8; 34 -2,-8; 35 -1.5,-8; 36 -1,-8; 37 -0.5,-8; 38 0,-8; 39 0.5,-8; 40 1,-8; 41 1.5,-8; 42 2,-8; 43 2.5,-8; 44 3,-8; 45 3.5,-8; 46 4,-8; 47 4.5,-8; 48 5,-8; 49 5.5,-8; 50 6,-8; 76 6,8; 77 5.5,8; 78 5,8; 79 4.5,8; 80 4,8; 81 3.5,8; 82 3,8; 83 2.5,8; 84 2,8; 85 1.5,8; 86 1,8; 87 0.5,8; 88 0,8; 89 -0.5,8; 90 -1,8; 91 -1.5,8; 92 -2,8; 93 -2.5,8; 94 -3,8; 95 -3.5,8; 96 -4,8; 97 -4.5,8; 98 -5,8; 99 -5.5,8; 100 -6,8
DF13A-4P-1.25H = smd 0.7 x 1.8: 1 -1.875,-3.3; 2 -0.625,-3.3; 3 0.625,-3.3; 4 1.875,-3.3 | smd 1.6 x 2.2: S1 4.225,0; S2 -4.225,0
DF13A-6P-1.25H = smd 0.7 x 1.8: 1 -3.125,-3.3; 2 -1.875,-3.3; 3 -0.625,-3.3; 4 0.625,-3.3; 5 1.875,-3.3; 6 3.125,-3.3 | smd 1.6 x 2.2: S1 5.475,0; S2 -5.475,0
MAXSONAR = drill 0.8: AN -5.08,0; GND -15.24,0; PW -2.54,0; RX -7.62,0; TX -10.16,0; VDD -12.7,0 | drill 0.8 square: BW 0,0 | drill 3.1: P$1 -0.84,-16
MOLEX-47346-0001 = smd 1.7 x 0.44: D+ 2.8,0; D- 2.8,0.65; GND 2.8,-1.3; ID 2.8,-0.65; VBUS 2.8,1.3 | smd 1.9 x 2.375: GND1 0,2.95; GND4 0,-2.95 | smd 2.1 x 1.475: GND2 2.3,2.5; GND3 2.3,-2.5 | smd 1.9 x 1.175: GND5 0,-0.838; GND6 0,0.838
FTSH-105-01-XXX-DV-K = smd 0.737 x 2.794: 1 -2.54,-2.032; 2 -2.54,2.032; 3 -1.27,-2.032; 4 -1.27,2.032; 5 0,-2.032; 6 0,2.032; 7 1.27,-2.032; 8 1.27,2.032; 9 2.54,-2.032; 10 2.54,2.032
SJ_3_0603_PASTE1&2 = smd 0.7 x 0.9: 1 -0.65,0; 2 0.65,0; 3 1.95,0
0402-IND = smd 0.5 x 0.6: P$1 -0.5,0; P$2 0.5,0
LED-0603 = smd 0.8 x 0.8: A 0,-0.75; C 0,0.75
TSOP-6 = smd 0.7 x 1: 1 -0.95,-1.2; 2 0,-1.2; 3 0.95,-1.2; 4 0.95,1.2; 5 0,1.2; 6 -0.95,1.2
0402-RES = smd 0.5 x 0.6: P$1 -0.5,0; P$2 0.5,0
0402-RES' = smd 0.7 x 0.9: 1 -0.65,0; 2 0.65,0
EVQP7J01K = smd 1.4 x 1.05: A1 -1.8,0.725; A2 1.8,0.725; B3 -1.8,-0.725; B4 1.8,-0.725
SOT23-5 = smd 0.55 x 1.2: 1 -0.95,-1.3; 2 0,-1.3; 3 0.95,-1.3; 4 0.95,1.3; 5 -0.95,1.3
MSOP-8 = smd 0.4 x 1.02: 1 -0.975,-2.4; 2 -0.325,-2.4; 3 0.325,-2.4; 4 0.975,-2.4; 5 0.975,2.4; 6 0.325,2.4; 7 -0.325,2.4; 8 -0.975,2.4
L3G4200DH-MAN = smd 0.9 x 0.4: 1 -1.9,0.975; 2 -1.9,0.325; 3 -1.9,-0.325; 4 -1.9,-0.975; 9 1.9,-0.975; 10 1.9,-0.325; 11 1.9,0.325; 12 1.9,0.975 | smd 0.4 x 0.9: 5 -0.975,-1.9; 6 -0.325,-1.9; 7 0.325,-1.9; 8 0.975,-1.9; 13 0.975,1.9; 14 0.325,1.9; 15 -0.325,1.9; 16 -0.975,1.9
MOUNT-HOLE3.1 = drill 3.1 pad 4.1: P$1 0,0
CLCC-48 = smd 0.42 x 3.5: 1 -0.4,5.84 | smd 0.42 x 2: 2 -1.2,5.84; 3 -2,5.84; 4 -2.8,5.84; 5 -3.6,5.84; 6 -4.4,5.84; 19 -4.4,-5.84; 20 -3.6,-5.84; 21 -2.8,-5.84; 22 -2,-5.84; 23 -1.2,-5.84; 24 -0.4,-5.84; 25 0.4,-5.84; 26 1.2,-5.84; 27 2,-5.84; 28 2.8,-5.84; 29 3.6,-5.84; 30 4.4,-5.84; 43 4.4,5.84; 44 3.6,5.84; 45 2.8,5.84; 46 2,5.84; 47 1.2,5.84; 48 0.4,5.84 | smd 2 x 0.42: 7 -5.84,4.4; 8 -5.84,3.6; 9 -5.84,2.8; 10 -5.84,2; 11 -5.84,1.2; 12 -5.84,0.4; 13 -5.84,-0.4; 14 -5.84,-1.2; 15 -5.84,-2; 16 -5.84,-2.8; 17 -5.84,-3.6; 18 -5.84,-4.4; 31 5.84,-4.4; 32 5.84,-3.6; 33 5.84,-2.8; 34 5.84,-2; 35 5.84,-1.2; 36 5.84,-0.4; 37 5.84,0.4; 38 5.84,1.2; 39 5.84,2; 40 5.84,2.8; 41 5.84,3.6; 42 5.84,4.4
LENSMOUNT_LARGE_M12 = drill 2.05: P$1 -11,0; P$2 11,0
OSCILLATOR-3.2X2.5 = smd 1.4 x 1.2: 1 -1.1,-0.85; 2 1.1,-0.85; 3 1.1,0.85; 4 -1.1,0.85

### Placement (x,y rotation side)
!RESET  1.04,42.04 180 bottom
ADDR0  13,26.5 180 bottom
ADDR1  13,28.9 180 bottom
ADDR2  13,31.3 180 bottom
BOOT0  5.9,23.6 90 bottom
BOOT1  20,38.3 315 bottom
C1  24.3,5.6 45 top
C2  17.7,20.6 0 top
C3  8p  [0402-CAP']  21.86,23.94 45 top
C4  8p  [0402-CAP']  21.73,27.07 135 top
C5  22.2,36.8 315 top
C6  27.63,2.95 45 top
C7  32.02,9.63 0 top
C8  19.1,41.3 0 top
C9  16.9,23.9 315 top
C10  20.76,28.7 45 top
C11  17.5,42.9 0 top
C12  1.99,38.28 90 top
C13  32,5.55 180 top
C15  22.4,30.4 225 top
C16  10.9,18.8 225 top
C17  3.79,40.38 180 top
C18  9.5,11.9 90 top
C19  25.55,9.25 270 top
C20  25.55,16.1 270 top
C21  5.59,8.09 270 top
C22  25.55,12.7 270 top
C23  12.09,1.28 180 top
C24  16.97,1.28 0 top
C25  6.69,7.4 270 top
C26  14.53,1.28 180 top
C27  28.96,7.67 90 top
C28  0.69,37.88 90 top
C29  5.9,20.66 180 top
C30  2.96,5.32 0 top
C31  28.5,1.56 225 top
C32  21.84,1.28 0 top
D1  33.12,12.19 0 top
IC1  11.5,33.5 135 top
J1  32.1,39.7 270 top
J2  2.9,35.6 270 bottom
J3  32.1,38.5 90 bottom
J4  26.69,44.59 0 top
J5  32.48,19 180 top
J6  3.93,18.2 270 bottom
JP1  6.97,44.49 0 top
JP2  6.8,39.8 270 bottom
L1  26.3,37.2 0 top
L2  26.3,42.7 0 top
L8  32.62,13.58 180 top
L11  19.41,1.28 180 top
LED1  3.52,15.3 270 top
LED2  3.52,17.69 270 top
LED3  3.52,18.89 270 top
LED4  3.52,16.49 270 top
OTG_DM  29.4,32.2 45 bottom
OTG_DP  29.4,29.7 45 bottom
Q1  22.6,41.3 180 top
R1  12,4.3 180 top
R2  10.5,5.8 180 top
R3  100  [0402-RES']  26.3,41.3 0 top
R4  100  [0402-RES']  26.3,39.9 0 top
R5  10K  [0402-RES']  26.3,38.5 0 top
R6  22R  [0402-RES']  26.3,33.51 180 top
R7  10k  [0402-RES']  26.3,35.9 180 top
R8  22R  [0402-RES']  26.3,34.71 180 top
R9  10k  [0402-RES']  21,4.3 180 top
R10  1k  [0402-RES']  4.08,22.89 270 top
R11  0R  [0402-RES']  3.5,20.7 0 top
R13  270R  [0402-RES']  5.91,15.3 180 top
R14  270R  [0402-RES']  5.91,17.69 180 top
R15  270R  [0402-RES']  5.91,18.89 180 top
R16  10K  [0402-RES']  1.3,40.38 180 top
R17  270R  [0402-RES']  5.91,16.49 180 top
R18  10K  [0402-RES']  5.9,21.98 0 top
R19  1k  [0402-RES']  9.5,15.3 270 top
R20  1k  [0402-RES']  9.5,8.5 270 top
S1  2.89,42.47 180 top
U1  32,7.58 270 top
U8  6.97,3.32 45 top
U12  2.6,8.42 270 top
U$1  32.7,2.3 0 top
U$2  2.3,26.3 0 top
U$3  2.3,2.3 0 top
U$4  32.7,26.3 0 top
U$5  17.5,12.3 0 top
U$8  17.5,12.3 0 top
U$10  26.73,3.92 0 bottom
USART2_RX  7.9,33.7 135 bottom
USART2_TX  7.9,36.1 135 bottom
USART3_RX  27.23,38.26 315 bottom
USART3_TX  27.23,40.8 315 bottom
USB_VBUS  27.4,25.3 135 bottom
VDD_3V3  14.33,0.88 0 bottom
VDD_3V3_ANALOG  14.33,3.21 0 bottom
VDD_5V  3.76,43.3 0 bottom
VDD_5V_IN  27.23,35.72 315 bottom
X1  19.5,25.3 225 top

### Tracks (layer width: path | path; a pad name or v marks a point on that pad's centre or on a via)
!JTRST  (via drill 0.3)
  Top 0.2: IC1.90 5.9,26.48 v5.9,24.91
  Route2 0.203: v1.81,13.71 2.71,13.71 3.11,14.11 3.11,18.79 5.2,20.88 5.2,23.2 5.9,23.9 v5.9,24.91
  Bottom 0.203: J6.10 1.81,15.57 v1.81,13.71
!RESET  (via drill 0.3)
  Top 0.25: IC1.14 16.31,29.4 v15.5,29.4 | C17.2 3.14,41.34 3.6,41.8 4,41.8 4.32,42.12 S1.A1 5.29,41.16
  Top 0.254: v12.1,37.5 11.75,37.85 v8.05,37.85 | R16.1 C17.2
  Top 0.3: v5.29,40.7 5.29,41.16
  Route2 0.25: v8.05,37.85 5.29,40.61 v5.29,40.7
  Bottom 0.25: !RESET.P$1 1.34,42.04 1.7,42.4 4.04,42.4 S1.A1 4.69,41.29 v5.29,40.7
  Bottom 0.254: v15.5,29.4 15.6,29.5 15.6,30.3 12.3,33.6 12.3,37.3 v12.1,37.5
ADC123_IN10  (via drill 0.3)
  Top 0.2: 17.2,29.21 IC1.15 | IC1.15
  Top 0.203: v17.1,36.9 17.1,35.1 16.8,34.8 16.8,34.2 18.1,32.9 18.1,30.7 17.2,29.8 17.2,29.21
  Route15 0.203: v17.1,36.9 18.3,38.1 18.3,41.29 J4.AN
ADDR0  (via drill 0.3)
  Top 0.2: IC1.7 14.41,26.35 | 14.41,26.35
  Top 0.203: v13.85,26.35 14.41,26.35
  Bottom 0.203: v13.85,26.35 13.7,26.5 ADDR0.2
ADDR1  (via drill 0.3)
  Top 0.2: IC1.8 14.31,27.15 v13.9,27.15
  Top 0.203: v13.9,27.15 14.31,27.15
  Bottom 0.203: v13.9,27.15 13.9,28.45 13.45,28.9 ADDR1.2
ADDR2  (via drill 0.3)
  Top 0.2: IC1.9 14.55,27.62 v14.55,28.4
  Bottom 0.203: v14.55,28.4 13.75,29.2 13.75,30.75 13.2,31.3 ADDR2.2
BOOT0  (via drill 0.3)
  Top 0.2: IC1.94 7.14,24.9 v6.8,24.9
  Top 0.203: R18.2 6.55,24.31 7.02,24.78 6.92,24.78 v6.8,24.9
  Bottom 0.24: BOOT0.P$1 5.9,23.66 6.67,24.43 6.67,24.77 v6.8,24.9
CAM_NRESET  (via drill 0.3)
  Top 0.2: IC1.30 18.8,35.14 | 18.8,35.14
  Top 0.203: 23.84,6.44 24.7,7.3 24.7,8.5 24.5,8.7 U$5.32 22,8.7 v18.8,11.9 | R9.1 23,4.3 C1.1 | v18.8,32.1 18.8,35.14
  Top 0.305: 23.84,6.44 23.84,6.43 23.57,6.16 23.57,5.41 C1.1
  Bottom 0.2: 19.3,17.1 19.3,17.2 18.6,17.9 18.6,31.9 v18.8,32.1
  Bottom 0.203: v18.8,11.9 19.3,12.4 19.3,17.1
DCMI_D0  (via drill 0.3)
  Top 0.2: 8.1,36.9 | 8.1,36.9 IC1.63
  Top 0.203: 8.1,36.9 | 8.1,36.9 8.2,36.8 16.1,36.8 v16.5,36.4 | U$5.43 21.9,16.58 21.23,15.91 20.79,15.91 v20.3,16.4
  Bottom 0.203: v16.5,36.4 20.3,32.6 v20.3,16.4
DCMI_D1  (via drill 0.3)
  Top 0.203: 7.19,37.1 7.2,37.1 8,36.3 15.6,36.3 v16.4,35.5 | v21.3,20.21 21.84,19.67 22.76,19.67 23.06,19.37 23.06,16.98 U$5.42 | 7.19,37.1 | 7.19,37.1 IC1.64
  Route2 0.203: v17.7,36.1 17.1,35.5 v16.4,35.5
  Bottom 0.203: v17.7,36.1 20.8,33 20.8,21.83 20.83,21.8 20.83,20.68 v21.3,20.21
DCMI_D2  (via drill 0.3)
  Top 0.2: IC1.97 8.36,24 | 8.36,24
  Top 0.203: 8.36,24 8.1,24 v7.8,23.7 | v24.89,19.16 24.89,19.77 24.46,20.2 22.53,20.2 20.52,22.21 15.04,22.21 14.63,21.8 13.01,21.8 12.6,22.21 12.5,22.21 12.49,22.22 v11.78,22.22 | v21.84,14.29 21.84,15.61 22.05,15.81 23.25,15.81 U$5.41
  Route2 0.203: v7.8,23.7 10.3,23.7 v11.78,22.22
  Bottom 0.203: v24.89,19.16 24.89,17.33 v21.84,14.29
DCMI_D3  (via drill 0.3)
  Top 0.2: IC1.98 7.8,22.73 v7.8,22.7
  Top 0.203: U$5.15 12.78,10.3 13.72,11.24 13.72,11.95 13.41,12.25 v13.41,12.56
  Route2 0.2: v11.8,20.9 10,22.7 v7.8,22.7
  Bottom 0.203: v11.8,20.9 11.8,20.57 12.09,20.28 12.6,20.28 13.11,19.77 13.11,16.93 13.31,16.73 13.31,16.01 14.02,15.3 14.02,13.27 13.41,12.66 v13.41,12.56
DCMI_D4  (via drill 0.3)
  Top 0.2: IC1.3 14.2,23.73 14.2,23.3 13.6,22.7 v13.6,22.4
  Top 0.203: U$5.16 12.69,9.5 14.12,10.93 14.12,12.46 15.11,13.45 v15.11,15.7
  Bottom 0.203: v15.11,15.7 14.4,16.41 14.4,21.6 v13.6,22.4
DCMI_D5  (via drill 0.3)
  Top 0.2: IC1.92 8.53,27.7 | 8.53,27.7
  Top 0.203: v10.8,27.7 8.53,27.7 | U$5.17 12.7,8.7 13.69,9.69 v13.71,9.69
  Bottom 0.203: v10.8,27.7 10.7,27.6 10.7,11.6 12,10.3 13.1,10.3 v13.71,9.69
DCMI_D6  (via drill 0.3)
  Top 0.2: 13.34,25.3 IC1.4 | IC1.4
  Top 0.203: v14.71,10.4 v14.71,12.1 | v12.6,25.3 13.34,25.3 | v11.48,7.07 11.48,7.72 U$5.18
  Bottom 0.203: v12.6,25.3 12.6,22.2 13.8,21 13.8,16.13 14.53,15.4 14.53,12.28 v14.71,12.1 | v11.48,7.07 11.89,7.07 13.82,9 14.22,9 14.73,9.51 14.73,10.38 v14.71,10.4
DCMI_D7  (via drill 0.3)
  Top 0.2: IC1.5 15,24.34 15,24.1 14.75,23.85 14.75,22.91 14.7,22.86
  Top 0.203: U$5.19 13.21,6.57 13.21,8.39 13.82,9 14.22,9 15.71,10.49 v15.71,11.5 | v14.5,22.65 14.7,22.86
  Bottom 0.203: 15.1,21.9 15.1,19.51 15.71,18.9 v15.71,11.5
  Bottom 0.21: 15.1,21.9 15.1,22.05 v14.5,22.65
DCMI_D8  (via drill 0.3)
  Top 0.2: IC1.78 3.6,32.68 | 3.6,32.68
  Top 0.203: U$5.45 20.22,18.22 20.22,20.89 19.71,21.4 15.65,21.4 15.04,20.79 v13.01,20.79 | v8.03,29.93 8.03,31.66 7.01,32.68 3.6,32.68
  Route2 0.203: v13.01,20.79 13.01,22.72 9.75,25.97 9.75,28.61 8.43,29.93 v8.03,29.93
DCMI_D9  (via drill 0.3)
  Top 0.2: IC1.80 3.84,31.5 6.2,31.5 7.4,30.3 7.4,29.5 7.88,29.02 v8.03,29.02
  Top 0.203: U$5.44 21.1,19.3 20.62,19.77 20.62,21.4 20.22,21.8 15.34,21.8 14.94,21.4 12.5,21.4 v12.29,21.6
  Route2 0.203: v12.29,21.6 12.39,21.5 12.39,22.52 9.14,25.77 9.14,28.41 8.53,29.02 v8.03,29.02
DCMI_HSYNC  (via drill 0.3)
  Top 0.2: 20.38,35.98 | 20.38,35.98 IC1.29
  Top 0.203: U$5.20 13.9,8.1 v14.2,8.4 | v20.7,37.5 20.8,37.4 20.8,37.1 21,36.9 21,36.6 20.38,35.98
  Bottom 0.203: v14.2,8.4 18.2,8.4 21.1,11.3 21.1,14.6 23,16.5 23,21.16 22.25,21.91 22.25,31.95 22.9,32.6 22.9,34 20.7,36.2 v20.7,37.5
DCMI_PIXCK  (via drill 0.3)
  Top 0.2: IC1.31 17.6,34.65 v17.6,34.4
  Top 0.203: U$5.46 19.5,19.8 v19.6,19.9 | v17.6,34.4 17.6,34.65
  Bottom 0.2: v19.6,19.9 19.6,20 19.8,20.2 19.8,32.2 v17.6,34.4
DCMI_VSYNC  (via drill 0.3)
  Top 0.2: 8.64,27.1 IC1.93 | IC1.93
  Top 0.203: U$5.21 14.7,7.7 15.2,8.2 v15.2,9.1 | v11.3,27.1 8.64,27.1
  Bottom 0.203: v11.3,27.1 11.2,27 11.2,11.9 12.1,11 15.07,11 15.65,10.43 15.65,9.55 v15.2,9.1
GND  (via drill 0.3)
  Top 0.25: IC1.99 11.04,25.26 | 11.04,25.26 | 1.95,35.29 1.1,36.15 v1.1,36.1 | IC1.46 14.94,42.6 15.3,42.6 15.8,42.1 19.5,42.1 19.75,41.85 C8.2 | IC1.27 22.12,36.34 C5.2 23.4,37.08 v23.4,37.1
  Top 0.254: 23.88,31.59 v23.89,31.6 23.89,30.46 23.16,29.73 22.16,29.73 C15.2 21.94,29.88 C10.2 20.8,29.16 IC1.20 | 11.04,25.26 v11.79,25.26 | IC1.74 1.95,35.29
  Top 0.3: v3.97,39.18 3.71,38.93 C12.2 | C28.2 0.72,38.5 1.1,38.5 1.53,38.93 C12.2 | U12.13 C21.2 6.28,6.75 C25.2 6.64,6.7 5.4,6.7 v5.2,6.5 | C12.2 1.99,38.81 2,38.8 2,38.9 | C11.2 18.1,42.9 v18.1,43.8 | IC1.46 | IC1.46 IC1.45 IC1.44 | IC1.10 17.28,25.6 17.6,25.6 18.08,25.12 X1.2 18.12,24.62 17.9,24.4 17.9,23.98 C9.2 16.72,22.8 v15.5,22.8 | v4.7,32.1 4.8,32.1 | R5.2 27.3,38.5 28,37.8 28.77,37.8 J1.4 29.98,37.83 v30.4,37.4 | C7.2 32.7,9.63 v32.7,10.6 | S1.B3 4.59,43.3 v2.5,43.3 | J5.GND 29.68,21.01 J5.GND3 | J5.GND3 32.03,21.51 J5.GND4 | J5.GND3 30.18,22.72 v30.48,23.02 | J5.GND1 32.03,16.51 J5.GND2 30.18,15.6 v30.48,15.3
  Top 0.305: U$5.38 24.5,13.5 24.7,13.3 24.7,12.75 25.4,12.05 C22.2 | U$5.34 24.5,10.3 24.7,10.1 24.7,9.3 25.4,8.6 C19.2 25.55,6.85 C1.2 | U$5.29 v21.1,7.9 | U8.1 U8.2 U8.3 U8.4 | U$5.7 11.66,17.12 C16.2 | C18.2 9.65,12.7 U$5.12 | C8.2 20.4,41.3 v20.7,41.6 21.6,42.5 Q1.3 | U$5.48 v17.9,16.6 | R18.1 C29.2 5.28,20.63 5.28,20.18 5.69,19.77 7.72,19.77 v8.03,20.08 | v25.8,11.15 25.55,11.4 25.55,12 | U1.2 31.6,7.58 31.8,7.38 31.8,6.26 31.35,5.81 C13.2 | 6.66,15.25 6.66,14.75 6.3,14.39 4.24,14.39 v4.22,14.4 | C17.1 4.44,39.65 v3.97,39.18 | C4.P$1 22.08,26.68 | 22.08,26.68 X1.4 21.03,25.48 C3.P$2 | 22.08,26.68 22.46,26.3 v23.8,26.3
  Top 0.381: 10.39,1.28 C23.2 11.44,2.36 v11.48,2.4 | C26.2 13.88,2.14 v13.82,2.2 | C24.2 17.62,2.14 v17.68,2.2 | U12.12 3.57,5.36 C30.2 | U12.12 U12.11 U12.10 U12.9 0.96,6.52 0.7,6.78 U12.8 | U12.12 4.32,6.52 4.5,6.69 U12.13 | 10.39,1.28 | 10.39,1.28 U8.4
  Top 0.4: U$5.48 17.9,19.5 18.3,19.9 18.3,20.55 C2.2 | v30.3,41.7 30.3,41.6 | 6.66,15.25 6.61,15.25 R13.1 | C31.2 27.51,1.1 C6.C
  Top 0.406: C20.2 v25.55,14.5 | v21.7,10.9 22.3,10.3 U$5.34 | U$5.11 U$5.12 U$5.13 12.9,11.9 13.1,11.7 v13.1,11.6 | U$5.9 v13.1,15.1 13.2,15.2 13.2,16.3 12.8,16.7 U$5.7 | C22.2 25.55,12
  Top 0.762: C32.2 25.86,1.28
  Route15 0.305: v11.1,29.4 11.1,29.5
  Route15 0.406: v25.55,14.5 25.55,14.4
  Bottom 0.25: v1.1,36.1 1.1,36.2 | v4.7,32.1 5.08,32.48 J2.6
  Bottom 0.3: v5.2,6.5 5.2,6.4
  Bottom 0.305: ADDR0.1 ADDR1.1 | ADDR1.1 11.6,28.9 v11.1,29.4 | ADDR1.1 ADDR2.1 | J6.9 4.37,15.66 | 4.37,15.66 4.22,15.66 4.17,15.61 4.17,14.46 v4.22,14.4 | J6.5 4.42,18.2 4.17,17.94 4.17,15.86 4.37,15.66 | J6.3 7.42,19.47 v8.03,20.08
  Bottom 0.381: v11.48,2.4 11.38,2.4
  Bottom 0.4: J3.6 30.23,41.62 v30.3,41.7
  Bottom 0.406: 5.16,15.66 J6.9 | J6.5 J6.3
  other vias: 27.23,7.58 27.64,7.07 27.23,6.56 27.64,6.06 27.23,5.55 25.5,3.31 26.11,3.21 25.6,2.7 24.99,2.81 25.1,2.2
  pour Route15: 0,0.1 35,0.1 35,46.4 0,46.4
  pour Top (no thermals): 27.23,7.78 31.8,7.78 32,7.58 32,5.55 31.7,5.24 27.23,5.24 27.03,5.45 27.03,7.58
  pour Top (rank 3): 28.45,1.89 27.64,1.89 26.01,3.52 25.4,3.52 24.79,2.91 24.79,2.2 26.01,0.98 28.55,0.98 28.86,1.28 28.96,1.38
I2C1_SCL  (via drill 0.3)
  Top 0.2: IC1.95 9.25,26.3 | 9.25,26.3
  Top 0.203: 9.25,26.3 11.4,26.3 11.9,26.8 11.9,27.6 v14.6,30.3 | v24.4,41.3 R3.1
  Route2 0.203: v14.6,30.3 15,30.7 23.93,30.7 24.89,31.66 24.89,32.57 25.3,32.98 26.45,32.98 v27.1,32.33
  Bottom 0.203: v24.4,41.3 25.19,40.51 25.19,35.19 27.1,33.28 v27.1,32.33
I2C1_SCL_EXT
  Top 0.2: R3.2 27.1,41.3 28.1,40.3 28.77,40.3 J1.2
I2C1_SDA  (via drill 0.3)
  Top 0.2: IC1.96 9.46,25.8 | 9.46,25.8
  Top 0.203: 9.46,25.8 11.5,25.8 12.4,26.7 12.4,27.1 v14.75,29.45 | v24.6,39.1 24.6,39.3 25.2,39.9 R4.1
  Route2 0.2: 15.47,30.03 15.33,30.03 v14.75,29.45
  Route2 0.203: 15.47,30.03 23.88,30.03 25.7,31.86 v25.7,32.33 v25.7,32.34
  Bottom 0.203: v24.6,39.1 24.69,39.01 24.69,34.89 25.7,33.88 v25.7,32.34
I2C1_SDA_EXT
  Top 0.2: R4.2 27.2,39.9 28,39.1 28.77,39.1 J1.3
I2C2_SCL  (via drill 0.3)
  Top 0.2: IC1.47 13.3,41.66 13.3,41.2 14,40.5 v14,40.3
  Top 0.203: v17.9,10.2 U$5.25 17.9,5.2 17.3,4.6 13.99,4.6 v13.72,4.33 | v6.91,4.63 6.12,4.63 U8.6 | 13.63,4.24 v13.72,4.33 | R1.P$1 13.69,4.3 v13.72,4.33
  Bottom 0.203: v17.9,10.2 17.9,11.3 16.8,12.4 16.8,17.3 17.1,17.6 17.1,31.2 13.8,34.5 13.8,40.1 v14,40.3 | v13.72,4.33 12.39,4.33 11.68,5.04 7.32,5.04 v6.91,4.63
I2C2_SDA  (via drill 0.3)
  Top 0.2: IC1.48 12.8,41.87 v12.8,40.9
  Top 0.203: v17.1,10.8 U$5.24 17.1,5.3 16.9,5.1 12.74,5.1 v12.09,5.75 | v7.32,5.75 6,5.75 U8.5 | v12.09,5.75 v12.08,5.74 | R2.P$1 12.04,5.8 v12.09,5.75
  Bottom 0.203: v17.1,10.8 17.1,11.3 16.3,12.1 16.3,17.7 16.6,18 16.6,30.9 13.3,34.2 13.3,40.4 v12.8,40.9 | v7.32,5.75 v12.09,5.75
JTCK-SWCLK  (via drill 0.3)
  Top 0.2: 1.5,32.09 | 1.5,32.09 IC1.76
  Top 0.203: v1.1,32.48 1.5,32.09
  Route2 0.2: 1.1,32.3 1.1,31.5 4.7,27.9 4.7,24.4 4.2,23.9 4.2,23.31
  Route2 0.203: 1.1,32.29 1.1,32.3 v1.1,32.48 | 4.2,23.31 v3.1,22.2
  Bottom 0.203: J6.4 1.93,19.5 3.5,19.5 3.7,19.7 3.7,21.6 v3.1,22.2
JTDI  (via drill 0.3)
  Top 0.2: IC1.77 2.6,32.38 v2.6,33.19
  Route2 0.2: 2.6,31.46 2.6,31.09 5.9,27.8 5.9,25.7 5.2,25 5.2,23.9 4.7,23.4 4.7,21.19 4.7,21.18
  Route2 0.203: 4.7,21.18 2.41,18.9 v2.41,14.3 | 2.6,31.46 v2.6,33.19
  Bottom 0.203: J6.8 1.93,16.9 3.6,16.9 3.7,16.8 3.7,15.1 3.4,14.8 2.81,14.8 2.41,14.4 v2.41,14.3
JTDO  (via drill 0.3)
  Top 0.2: IC1.89 5.3,26.59 v5.3,25.9
  Bottom 0.203: J6.6 3.51,18.2 4.2,18.89 4.2,21.33 4.88,22.01 4.88,24.04 5.28,24.45 5.28,25.88 v5.3,25.9
JTMS-SWDIO  (via drill 0.3)
  Top 0.2: 2.4,33.8 3.4,34.8 3.4,35.2 2.66,35.94 IC1.72
  Top 0.203: v1,33.4 1.4,33.8 2.4,33.8
  Route15 0.2: v1,33.4 1.2,33.4 1.7,32.9 1.7,31.2 5.9,27 5.9,25.7 5.2,25 5.2,23.4 3.3,21.5 2.3,21.5 v2.2,21.6
  Bottom 0.2: v2.2,21.6 2.2,21.04 J6.2
LED_AMBER
  Top 0.203: IC1.1 12.36,23.6 11.07,22.31 11.07,20.69 8.03,17.64 6.61,17.64 R14.1
LED_BLUE
  Top 0.203: IC1.2 13.27,23.98 12.6,24.65 12.39,24.65 10.26,22.52 10.26,20.99 8.13,18.86 6.59,18.86 R15.1
LED_RED  (via drill 0.3)
  Top 0.203: v12.7,38.3 16.3,38.3 IC1.38 | 15.5,20.3 v15.7,20.5 15.18,19.98 12.9,19.98 12.6,20.28 11.28,20.28 9.45,18.45 9.45,17.44 8.53,16.52 6.59,16.52 R17.1
  Bottom 0.203: v15.7,20.5 16.1,20.9 16.1,30.6 12.8,33.9 12.8,38.2 v12.7,38.3
N$1
  Top 0.3: IC1.13 17.9,27.1 19.2,27.1 19.62,26.68 X1.1
  Top 0.305: C4.P$2 20.92,27.42 20.2,26.7 19.7,26.7 X1.1
N$2
  Top 0.2: IC1.12 17.79,26.5 18.3,26.5 19.9,24.9 19.9,24.4 19.42,23.92 X1.3
  Top 0.3: 19.9,23.3 19.32,23.88 X1.3
  Top 0.305: C3.P$1 21.02,23.1 20.1,23.1 19.9,23.3
N$3
  Top 0.4: L2.P$2 27.68,42.7 J1.1
N$4
  Top 0.305: C13.1 33.3,6.2 U1.4
N$8
  Top 0.203: R17.2 LED4.C
N$10
  Top 0.203: U$5.8 11.61,15.95 R19.1
N$11  (via drill 0.3)
  Top 0.203: R20.1 9.25,9.15 v8.6,8.5 | U$5.10 12.9,14.3 13.2,14.01 v13.2,13.4
  Route2 0.203: v13.2,13.4 8.6,8.8 v8.6,8.5
N$13
  Bottom 0.35: JP2.2 6.8,39.33 J2.1
  Bottom 0.4: J2.1 6.2,38.6
N$23
  Top 0.406: D1.ANODE 33.77,12.92 L8.P$1
  Top 0.508: D1.ANODE
N$28
  Top 0.203: R15.2 LED3.C
N$29
  Top 0.203: R13.2 LED1.C
N$30
  Top 0.203: R14.2 LED2.C
N$34
  Top 0.2: C25.1 6.65,8.09 U12.14
OTG_FS_ID  (via drill 0.3)
  Top 0.2: IC1.69 6.56,34.2 7.3,34.2
  Top 0.203: 7.3,34.2 13.4,34.2 14.1,33.5 15.6,33.5 v15.7,33.6 | R7.2 23.9,35.9 v23.6,35.6
  Route2 0.203: v23.6,35.6 23.6,35.1 23.2,34.7 18.9,34.7 17.9,33.7 15.8,33.7 v15.7,33.6
OTG_FS_N  (via drill 0.3)
  Top 0.2: IC1.70 3.37,36.58 6.47,33.48 11.6,33.48 v11.6,33.65 | v24.8,33.7 24.9,33.8 25.36,33.8 R6.2
  Route2 0.2: v11.6,33.65 11.6,33.48 11.97,33.48 12.57,32.88 18.03,32.88 18.63,33.48 21.63,33.48 22.43,34.27 24.23,34.27 v24.8,33.7
OTG_FS_P  (via drill 0.3)
  Top 0.2: IC1.71 3.12,36.33 6.33,33.12 11.6,33.12 v11.6,32.95 | v23.6,33.7 24,33.7 24.7,34.4 25.34,34.4 R8.2
  Route2 0.2: v11.6,32.95 11.6,33.12 11.83,33.12 12.43,32.52 18.17,32.52 18.77,33.12 21.77,33.12 22.57,33.93 23.6,33.93 v23.6,33.7
OTG_ID
  Top 0.2: 30.18,25.67 30.18,29.58 30.8,30.2 30.8,32.8 30.18,33.43 | 29.36,19.67 29.66,19.67 J5.ID
  Top 0.203: R7.1 27.7,35.9 30.18,33.43 | 30.18,25.67 28.14,23.63 28.14,19.88 28.35,19.67 29.36,19.67
OTG_N  (via drill 0.3)
  Top 0.2: R6.1 27.94,33.51 29.23,32.23 29.23,31.4 | 29.23,31.4 29.23,26.07 27.12,23.97 27.12,19.03 27.63,18.53 29.51,18.53 J5.D- | v28.7,31.5 29.12,31.5 29.23,31.4
  Bottom 0.2: OTG_DM.P$1 v28.7,31.5
OTG_P  (via drill 0.3)
  Top 0.2: R8.1 27.24,34.71 29.57,32.37 29.57,30.7 | 29.57,30.7 29.57,25.93 27.48,23.83 27.48,19.17 27.77,18.88 29.55,18.88 J5.D+ | v30.1,30.7 29.57,30.7
  Bottom 0.2: OTG_DP.P$1 29.4,30 v30.1,30.7
PB2-BOOT1  (via drill 0.3)
  Top 0.2: IC1.37 18.21,39.5 20.5,39.5 | v20.9,39.1 21.5,38.5 R5.1
  Top 0.203: 20.5,39.5 v20.9,39.1
  Bottom 0.2: BOOT1.P$1 20.1,38.3 v20.9,39.1
SONAR_TX  (via drill 0.3)
  Top 0.203: v10.97,30.44 8.74,28.21 v8.03,28.21 | v1.64,22.92 1.64,21.26 2.2,20.7 R11.1
  Bottom 0.203: J4.TX 16.53,43.72 15.54,42.73 12.19,42.73 11.28,41.82 11.28,41.2 11.98,40.5 11.98,38.97 10.97,37.96 v10.97,30.44 | v8.03,28.21 6.71,26.89 5.39,26.89 4.67,26.17 4.67,24.55 4.37,24.24 4.37,23.33 3.96,22.92 v1.64,22.92
SPI2_MISO  (via drill 0.3)
  Top 0.2: v1.6,12.2 1.62,12.18 U12.4 | IC1.53 10.2,41.87 10.2,41.3
  Top 0.203: 10.2,41.3 8.8,39.9 v8.8,39.7 | U12.4
  Bottom 0.2: 9.2,11.99 7.51,10.3 5.5,10.3 3.4,12.4 1.8,12.4 v1.6,12.2
  Bottom 0.203: 9.2,11.99 9.2,31.4 9.3,31.5 9.3,39.2 v8.8,39.7
SPI2_MOSI  (via drill 0.3)
  Top 0.2: v2.3,13 2.27,12.97 U12.3 | IC1.54 9.7,41.66 9.7,41.4
  Top 0.203: 9.7,41.4 8.1,39.8 v8.1,39.2
  Bottom 0.2: 8.7,31.6 8.7,16.1 7,14.4 5.4,14.4 4.1,13.1 2.4,13.1 v2.3,13
  Bottom 0.203: 8.7,31.6 8.8,31.7 8.8,38.5 v8.1,39.2
SPI2_NSS  (via drill 0.3)
  Top 0.2: v0.7,10.1 U12.5 | 11.2,41 11.2,42.3 10.1,43.4 IC1.51 | IC1.51
  Top 0.203: 11.2,41 10.7,40.5 v10.7,39.7 | 0.72,9.41 U12.5
  Bottom 0.2: 10.2,11.77 10.2,11.7 7.8,9.3 5.3,9.3 4.5,10.1 v0.7,10.1
  Bottom 0.203: 10.2,11.77 10.2,30.9 10.4,31.1 10.4,38.9 10.7,39.2 v10.7,39.7
SPI2_SCK  (via drill 0.3)
  Top 0.2: v2.9,11.4 2.92,11.38 U12.2 | IC1.52 10.7,42.08 10.7,41.1
  Top 0.203: 10.7,41.1 9.9,40.3 v9.9,39.9 | 2.95,10.29 U12.2
  Bottom 0.2: 9.7,11.88 7.62,9.8 5.4,9.8 4.6,10.6 3.3,10.6 2.9,11 v2.9,11.4
  Bottom 0.203: 9.7,11.88 9.7,31.1 9.9,31.3 v9.9,39.9
TIM4_CH2  (via drill 0.3)
  Top 0.203: v14.53,38.98 12.49,38.98 12.08,38.57 7.62,38.57 7.32,38.87 7.32,39.08 7.52,39.28 7.52,39.6 IC1.60
  Bottom 0.2: 21.13,43.24 16.87,38.98 v14.53,38.98
  Bottom 0.203: J4.PW 24.15,44.53 22.86,43.24 21.13,43.24
TIM5_CH3_EXPOSURE  (via drill 0.3)
  Top 0.2: IC1.25 22,32.69 v22,32.6
  Top 0.203: U$5.23 16.3,9.2 v16.4,9.3
  Bottom 0.203: v16.4,9.3 16.5,9.4 18.4,9.4 20.5,11.5 20.5,14.8 22.5,16.8 22.5,20.74 21.74,21.5 21.74,32.34 v22,32.6
TIM5_CH4_STANDBY  (via drill 0.3)
  Top 0.2: 21.7,34.61 IC1.26 | IC1.26
  Top 0.203: U$5.33 22,9.5 19.8,11.7 v19.8,11.9 | 21.7,34.61 21.7,34.3 v21.5,34.1
  Bottom 0.203: v19.8,11.9 19.8,14.9 21.9,17 21.9,20.73 21.34,21.3 21.34,33.94 v21.5,34.1
TIM8_CH3_MASTERCLOCK  (via drill 0.3)
  Top 0.2: IC1.65 7.89,35.7 v15.3,35.7
  Top 0.203: U$5.47 18.7,17 18.6,16.9 v18.6,16.2
  Bottom 0.203: v15.3,35.7 18.1,32.9 18.1,17.3 18.6,16.8 v18.6,16.2
TIM8_CH4_LED_OUT  (via drill 0.3)
  Top 0.2: IC1.66 7.68,35.2 14.1,35.2
  Top 0.203: U$5.27 19.5,10.2 18,11.7 v18,12.9 | v14.5,34.9 14.4,34.9 14.1,35.2
  Bottom 0.203: v18,12.9 18,15 17.3,15.7 17.3,17 17.6,17.3 17.6,32.7 15.4,34.9 v14.5,34.9
UART4_RX
  Top 0.203: IC1.79 2.62,31.02 1.93,30.34 1.93,30.03 4.67,27.29 4.67,24.55 4.88,24.35 4.88,23.04 R10.2 4.08,20.77 R11.2
US_EN1  (via drill 0.3)
  Top 0.2: IC1.39 17.5,40.21 v17.5,40.6
  Bottom 0.203: v17.5,40.6 19.07,42.17 J4.RX
USART2_CTS  (via drill 0.3)
  Top 0.203: v5.5,30.8 5.1,30.4 5.1,29.93 IC1.84
  Bottom 0.2: v5.5,30.8 5.2,30.8 4.1,31.9 4.1,33.4 5.67,34.98 J2.4
USART2_RTS  (via drill 0.3)
  Top 0.2: IC1.85 5.5,29.62 5.5,30 5.7,30.2 v6.6,30.2
  Bottom 0.2: v6.6,30.2 6.8,30.2 7.8,31.2 7.8,32.6 6.67,33.73 J2.5
USART2_RX  (via drill 0.3)
  Top 0.203: v7.1,28.9 7,29 6.29,29 IC1.87
  Bottom 0.2: v7.1,28.9 7.1,29.8 8.3,31 8.3,33.3 USART2_RX.P$1 7.5,34.1 7.5,35.4 6.67,36.23 J2.3
USART2_TX  (via drill 0.3)
  Top 0.203: 6.19,29.6 v6.1,29.6 | 6.19,29.6 | 6.19,29.6 IC1.86
  Bottom 0.2: 6,29.6 5.8,29.6 3.7,31.7 3.7,35.7 5.47,37.48 J2.2 6.22,37.5 7,37.5 7.9,36.6 USART2_TX.P$1
  Bottom 0.203: v6.1,29.6 6,29.6
USART3_CTS  (via drill 0.3)
  Top 0.2: IC1.58 7.61,40.99 6.7,41.9 v6.7,42.8
  Route2 0.2: v6.7,42.8 6.7,42.9 7.9,44.1 9.1,44.1 10,43.2 20.3,43.2 21.2,42.3 24.5,42.3 v24.8,42
  Bottom 0.2: v24.8,42 25.9,40.9 25.9,40.5 26.5,39.9 27.6,39.9 28,40.3 28.73,40.3 J3.5
USART3_RTS  (via drill 0.3)
  Top 0.203: v6.11,42.11 6.11,41.72 IC1.59
  Route2 0.2: 30,39.7 v30.2,39.5 | 7.8,41.8 7.6,41.6 6.61,41.6 v6.11,42.11
  Route2 0.203: 7.7,41.8 7.8,41.8 17.9,41.8 20,39.7 30,39.7
  Bottom 0.2: v30.2,39.5 29.82,39.12 J3.4
USART3_RX  (via drill 0.3)
  Top 0.2: IC1.56 7.65,42.3 v7.3,42.3
  Route2 0.2: 30,40.2 31.1,40.2 v31.4,39.9
  Route2 0.203: v7.3,42.3 18.2,42.3 20.3,40.2 30,40.2
  Bottom 0.2: USART3_RX.P$1 27.2,38.23 27.2,37 27.57,36.62 J3.2 28.82,36.6 30.6,36.6 31.4,37.4 v31.4,39.9
USART3_TX  (via drill 0.3)
  Top 0.2: IC1.55 7.7,42.96 v7.7,43
  Route2 0.2: 30.39,40.7 30.6,40.7 v30.7,40.8
  Route2 0.203: v7.7,43 7.9,42.8 18.6,42.8 20.7,40.7 30.39,40.7
  Bottom 0.2: J3.3 28.82,37.9 29.7,37.9 30.8,39 30.8,40.7 v30.7,40.8 30.9,41 30.9,42.1 30.5,42.5 27.8,42.5 27.23,41.93 USART3_TX.P$1
VBUS  (via drill 0.3)
  Top 0.3: 4.71,36.75 IC1.68 | IC1.68
  Top 0.305: 4.71,36.75 5.45,36.75 7.5,34.7 13.6,34.7 14.1,34.2 v15.1,34.2 | v22.6,35.3 23,34.9 23,32.8 23.5,32.3 24.45,32.3 25.3,31.46 26.92,31.46 28.65,29.73 28.65,26.58 v28.25,26.17 | 28.51,17.71 28.1,17.71 v28.04,17.64
  Top 0.381: J5.VBUS 28.51,17.71 28.25,17.44 28.25,15.1 28.65,14.69 29.87,14.69 30.99,13.58 L8.P$2
  Route2 0.305: v15.1,34.2 15.6,34.7 16.6,34.7 16.9,35 17.5,35 17.8,35.3 v22.6,35.3
  Bottom 0.3: 28.04,24.68 28.02,24.68 USB_VBUS.P$1 28.2,26.1 28.25,26.1
  Bottom 0.305: v28.25,26.17 28.25,26.1 | v28.04,17.64 28.04,24.68
VCAP_1
  Top 0.2: IC1.49 13.82,43.6 14.3,43.6
  Top 0.3: 14.3,43.6 15.1,43.6 15.8,42.9 C11.1
VCAP_2
  Top 0.25: 2.31,35.65 1.7,36.26 1.7,36.9 1.99,37.19 C12.1
  Top 0.254: IC1.73 2.31,35.65
VDD_3V3  (via drill 0.3)
  Top 0.25: IC1.28 21.74,36.67 C5.1 22.38,37.9 v22.5,37.9 | IC1.6 15.5,24.55 v15.5,23.7 | v16.4,2.4 16.5,2.4 | IC1.11 15.8,27.79 15.8,28.2 v15.3,28.7 | v19.2,28 19.44,28.24 C10.1
  Top 0.254: IC1.19 20.3,28.94 C10.1 | IC1.100 8.09,21.6 v8.03,21.6 7.11,20.69 6.58,20.69 C29.1 | IC1.75 1.41,34.91 v1,34.5 0.41,35.09 0.41,36.64 0.71,36.94 0.71,37.21 | R16.2 0.65,39.65 v0.81,39.48
  Top 0.3: U12.1 3.57,11.07 v3.7,11.2 | IC1.50 12.1,42.59 v12.1,41.2 | IC1.43 16.06,41.6 16.6,41.6 v17,41.2 | C9.1 15.78,23.7 v15.5,23.7 | R19.2 9.34,14.65 v8.6,13.91 | C18.1 8.95,11.25 8.6,11.6 v8.6,13.91 | 8.6,14.01 v8.6,13.91
  Top 0.305: U$5.28 20.3,4.35 R9.2 v19.3,4.3 | U$5.31 23.34,7.04 v23.1,6.8 22.76,6.46 U$5.30 | 12.48,18.14 U$5.6 | C18.1 9.65,11.1 U$5.14 | v17,41.2 17.1,41.3 C8.1 | v12.4,19.6 11.7,19.6 C16.1 12.48,18.14 | LED3.A LED2.A LED4.A LED1.A 2.77,14.87 3.65,13.99 v3.65,13.78 | JP1.3 10.23,44.49 v10.16,44.56 | R20.2 v9.5,7 10,6.5 R2.P$2 10,5.2 10.9,4.3 R1.P$2 | 12.48,18.14 | 0.71,37.21 C28.1
  Top 0.381: C30.1 1.55,5.32 v1.52,5.35 | U8.8 4.59,4.32 v5.28,3.62
  Top 0.4: U$5.1 17.1,20.55 C2.1 16.9,20.6 v16,19.7
  Top 0.406: C29.1 6.55,20.64 | L11.P$1 v19.91,2.19 v19.9,2.2
  Top 0.508: L11.P$1 C32.1
  Route2 0.305: v12.4,19.6 12.5,19.6
  Bottom 0.25: VDD_3V3.P$1 14.95,1.5 15.4,1.5 16.3,2.4 v16.4,2.4
  Bottom 0.254: 8.03,21.5 v8.03,21.6 7.11,20.69 6.02,20.69 J6.1
  Bottom 0.3: v3.7,11.2 3.8,11.2
  Bottom 0.305: v12.1,41.2 12.5,41.6 16.6,41.6 v17,41.2 | J6.1
  Bottom 0.381: v5.28,3.62 5.38,3.62
  Bottom 0.4: v19.9,2.2 20,2.2
  other vias: 30.74,4.04 27.33,4.43 31.08,4.64 30.37,4.63 29.66,4.64
  pour Route2: 0,0.1 35,0.1 35,46.4 0,46.4
  pour Top (rank 3, no thermals): 32.82,11.85 34.95,11.85 34.95,5.75 33.53,4.33 31.9,4.33 29.46,1.89 27.43,3.92 27.03,4.33 27.03,4.94 27.33,5.24 31.5,5.24 31.5,10.53
VDD_3V3_ANALOG  (via drill 0.3)
  Top 0.25: 22.01,31.11 22.1,31.2 22.5,31.2 22.84,30.86 C15.1 23.2,31.2 23.2,31.6 v22.99,31.81 | 21.2,30.3 21,30.3 20.34,30.96 IC1.22
  Top 0.254: IC1.22 IC1.21 | 22.01,31.11 21.2,30.3
  Top 0.3: U12.15 C21.1
  Top 0.305: C22.1 24.6,14.3 U$5.39 U$5.40 24.5,15.1 24.7,15.3 24.7,16 25.45,16.75 C20.1 25.55,16.7 | C19.1 25.55,10.35 24.8,11.1 U$5.35 | C23.1 12.74,0.73 13.01,0.47 14.94,0.47 15.14,0.67 15.14,1.24 | 16.36,1.24 16.36,0.67 16.56,0.47 18.59,0.47 18.91,0.78 L11.P$2
  Top 0.381: C26.1 C24.1 16.36,1.24 | 15.14,1.24 C26.1 | 23.6,3.1 12.71,3.1 | 12.71,3.1 12.7,3.11 12.7,1.32 C23.1 | U12.16 U12.15 | 12.71,3.1 11.09,3.1 | C26.1 15.18,2.36 v15.14,2.4
  Top 0.4: 11.09,3.1 7.8,6.38 7.8,8.5 7.3,9 6.2,9 5.94,8.74 C21.1
  Top 0.406: 25.55,16.7 26.1,16.7 26.5,16.3 26.5,13.3 | 26.5,13.3 25.5,13.3 | 26.5,10 26.5,13.3 | 26.5,10 26.4,9.9 C19.1 25.55,10 26.5,10 | 26.5,10 26.5,6 23.6,3.1 | v23.8,17.9 24.4,17.9 C20.1
  Bottom 0.381: VDD_3V3_ANALOG.P$1 v15.14,2.4
  Bottom 0.406: v23.8,17.9 23.8,21.37 22.96,22.21 22.99,22.24 v22.99,31.81
VDD_5V  (via drill 0.3, 0.6)
  Top 0.25: R10.1 2.94,23.54 v2.85,23.63
  Top 0.254: v6.3,43.45 6.3,44.47 JP1.1
  Top 0.305: U1.3 30.38,6.3 v30.38,5.85
  Top 0.4: Q1.4 21.65,39.25 v21.8,39.1
  Top 0.6: v31.5,10.9 31.9,11.3 31.9,12.15 D1.CATHODE
  Route2 0.3: v11.3,40.3 12.8,40.3 13.5,39.6 19.4,39.6 20.6,38.4 21.1,38.4 v21.8,39.1
  Route2 0.6: v21.8,39.1 22.4,39.1 23.3,38.2 33.1,38.2 v33.4,37.9
  Route15 0.25: v1.1,29.1 3.1,29.1 4.7,27.5 4.7,24.74 3.5,23.54 2.94,23.54 v2.85,23.63
  Bottom 0.25: v1.1,29.1 1.3,29.3 1.3,31.2 1.7,31.6 2.8,31.6 3.3,32.1 3.3,37.6 5.8,40.1 5.8,40.4 6.2,40.8
  Bottom 0.254: VDD_5V.P$1 6.15,43.3
  Bottom 0.3: 6.15,43.3 v6.3,43.45 | 8.7,40.6 11,40.6 v11.3,40.3
  Bottom 0.305: v30.38,5.85 30.38,9.3 v30.48,9.41
  Bottom 0.35: 5.39,41.81 5.39,41.61 6.2,40.8 6.69,40.8 JP2.1 6.89,40.6 8.7,40.6
  Bottom 0.381: 5.39,41.81 5.39,42.54 v6.3,43.45
  Bottom 0.6: v33.4,37.9 33.8,37.5 33.8,31.6 29.6,27.4 29.6,14.9 31.6,12.9 31.6,11 v31.5,10.9
  pour Top (rank 2, no thermals): 27.03,8.19 27.03,8.09 27.33,7.78 31.8,7.78 32,7.99 32,10.83 32.82,11.64 32.82,12.76 30.78,12.76 27.03,9
VDD_5V_IN  (via drill 0.3)
  Top 0.4: Q1.6 23.55,39.15 v23.6,39.1 | v24.1,36.5 24.1,36.6 24.7,37.2 L1.P$1
  Top 0.406: Q1.1 Q1.2 | Q1.1 23.9,42.5 24.1,42.7 L2.P$1 | Q1.1 Q1.6 Q1.5
  Bottom 0.4: v23.6,39.1 23.6,38.9 24.1,38.4 v24.1,36.5
VDD_5V_IN_UART3  (via drill 0.3)
  Top 0.4: L1.P$2 27.6,37.2 v30.2,34.6
  Bottom 0.3: J3.1 27.58,35.38 VDD_5V_IN.P$1
  Bottom 0.4: v30.2,34.6 29.57,34.6 J3.1
VDD_SONAR  (via drill 0.3)
  Top 0.4: v8.3,43.5 7.62,44.18 JP1.2
  Bottom 0.4: J4.VDD 12.9,43.5 v8.3,43.5

### Text on the board
tPlace: . | . | J4 | RST | 1 | . | J1 | I2C1 | M12x0.5 LENS | USB | ACT | COM | ERR | ON | J5 | Gute nuggets
bPlace: ULTRASOUND | J2 | . | . | J3 | I2C BUS ADDR | USART2 | 2 | USART3 | 1 | 0 | Y | X | Z | JTAG | J6 | (c) lm/dh | PX4FLOW v1.3
tDocu: 5.0V
bDocu: 5.0V | 3.3V | 3.3V from UART | 2 | 1 | I2C Address | 0